# EasyEDA schematic examplePart-Name.json

## Sheets
1 Sheet_1: TITLE: Sheet_1; REV: 1.0; Date: 2020-12-12; Sheet: 1/1; Drawn By: HUANsic; Company: Your Company
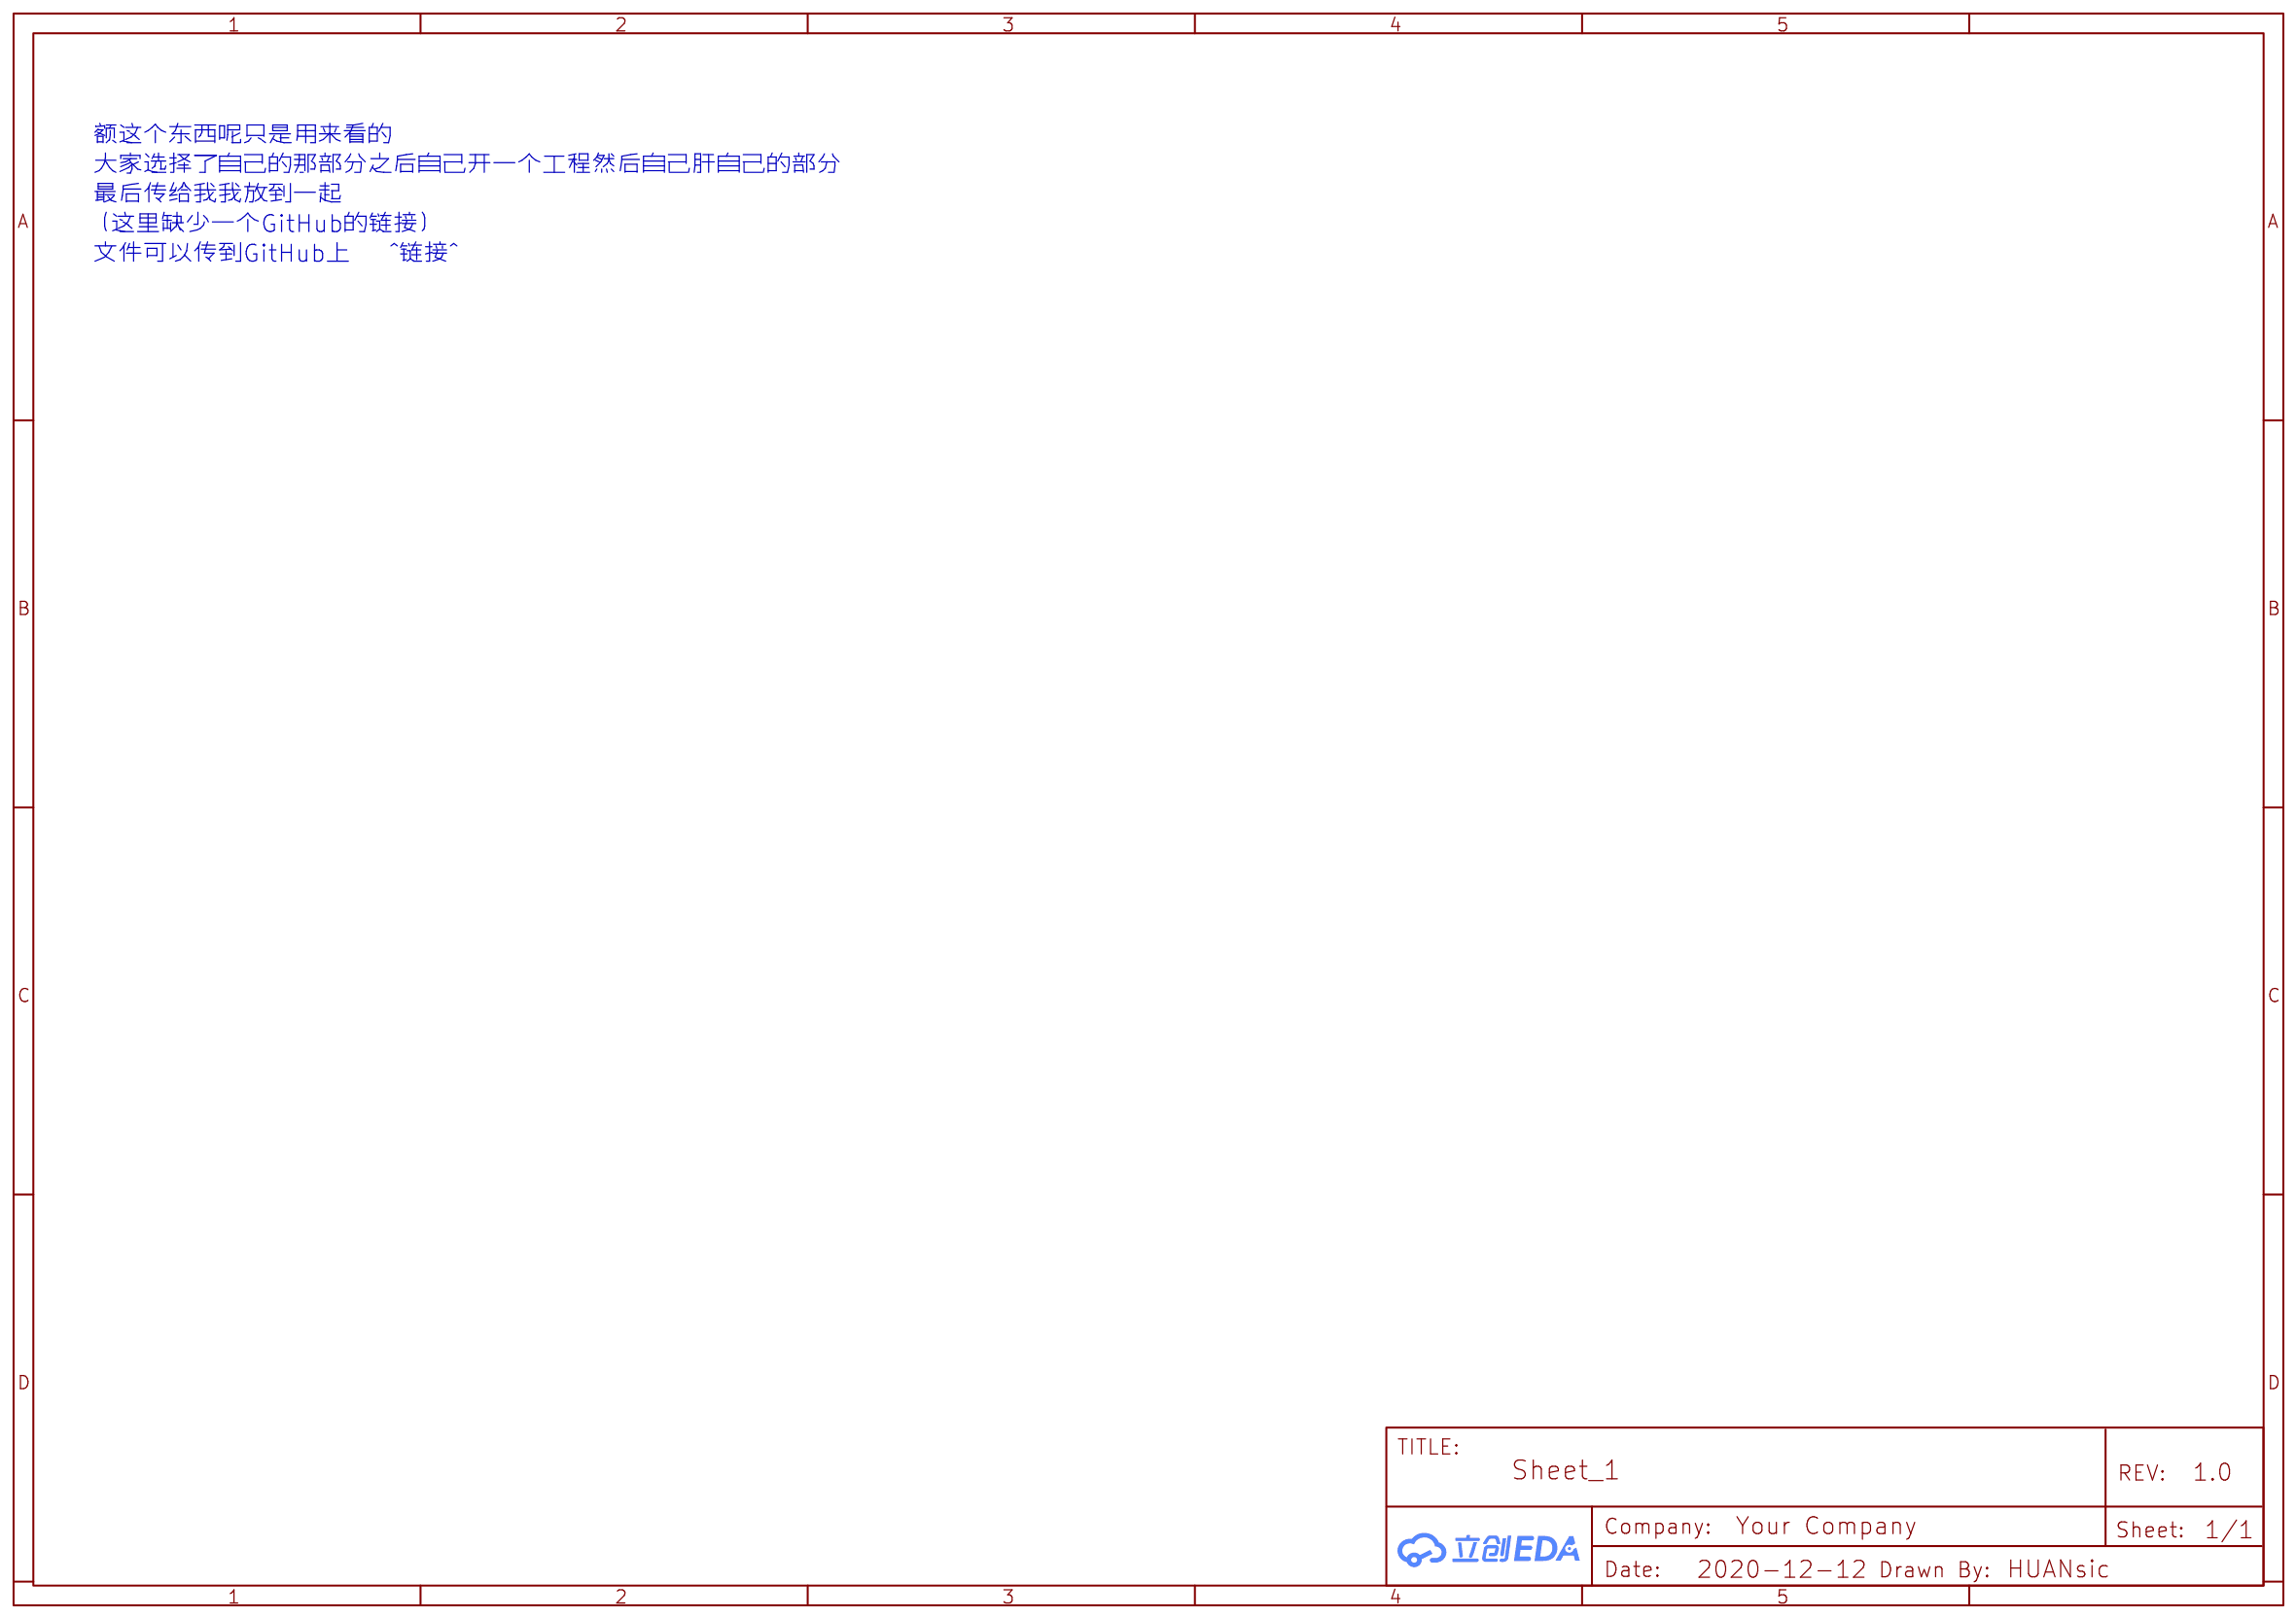
[diagram p0: Sheet_1]
2 RegFile: TITLE: Sheet_2
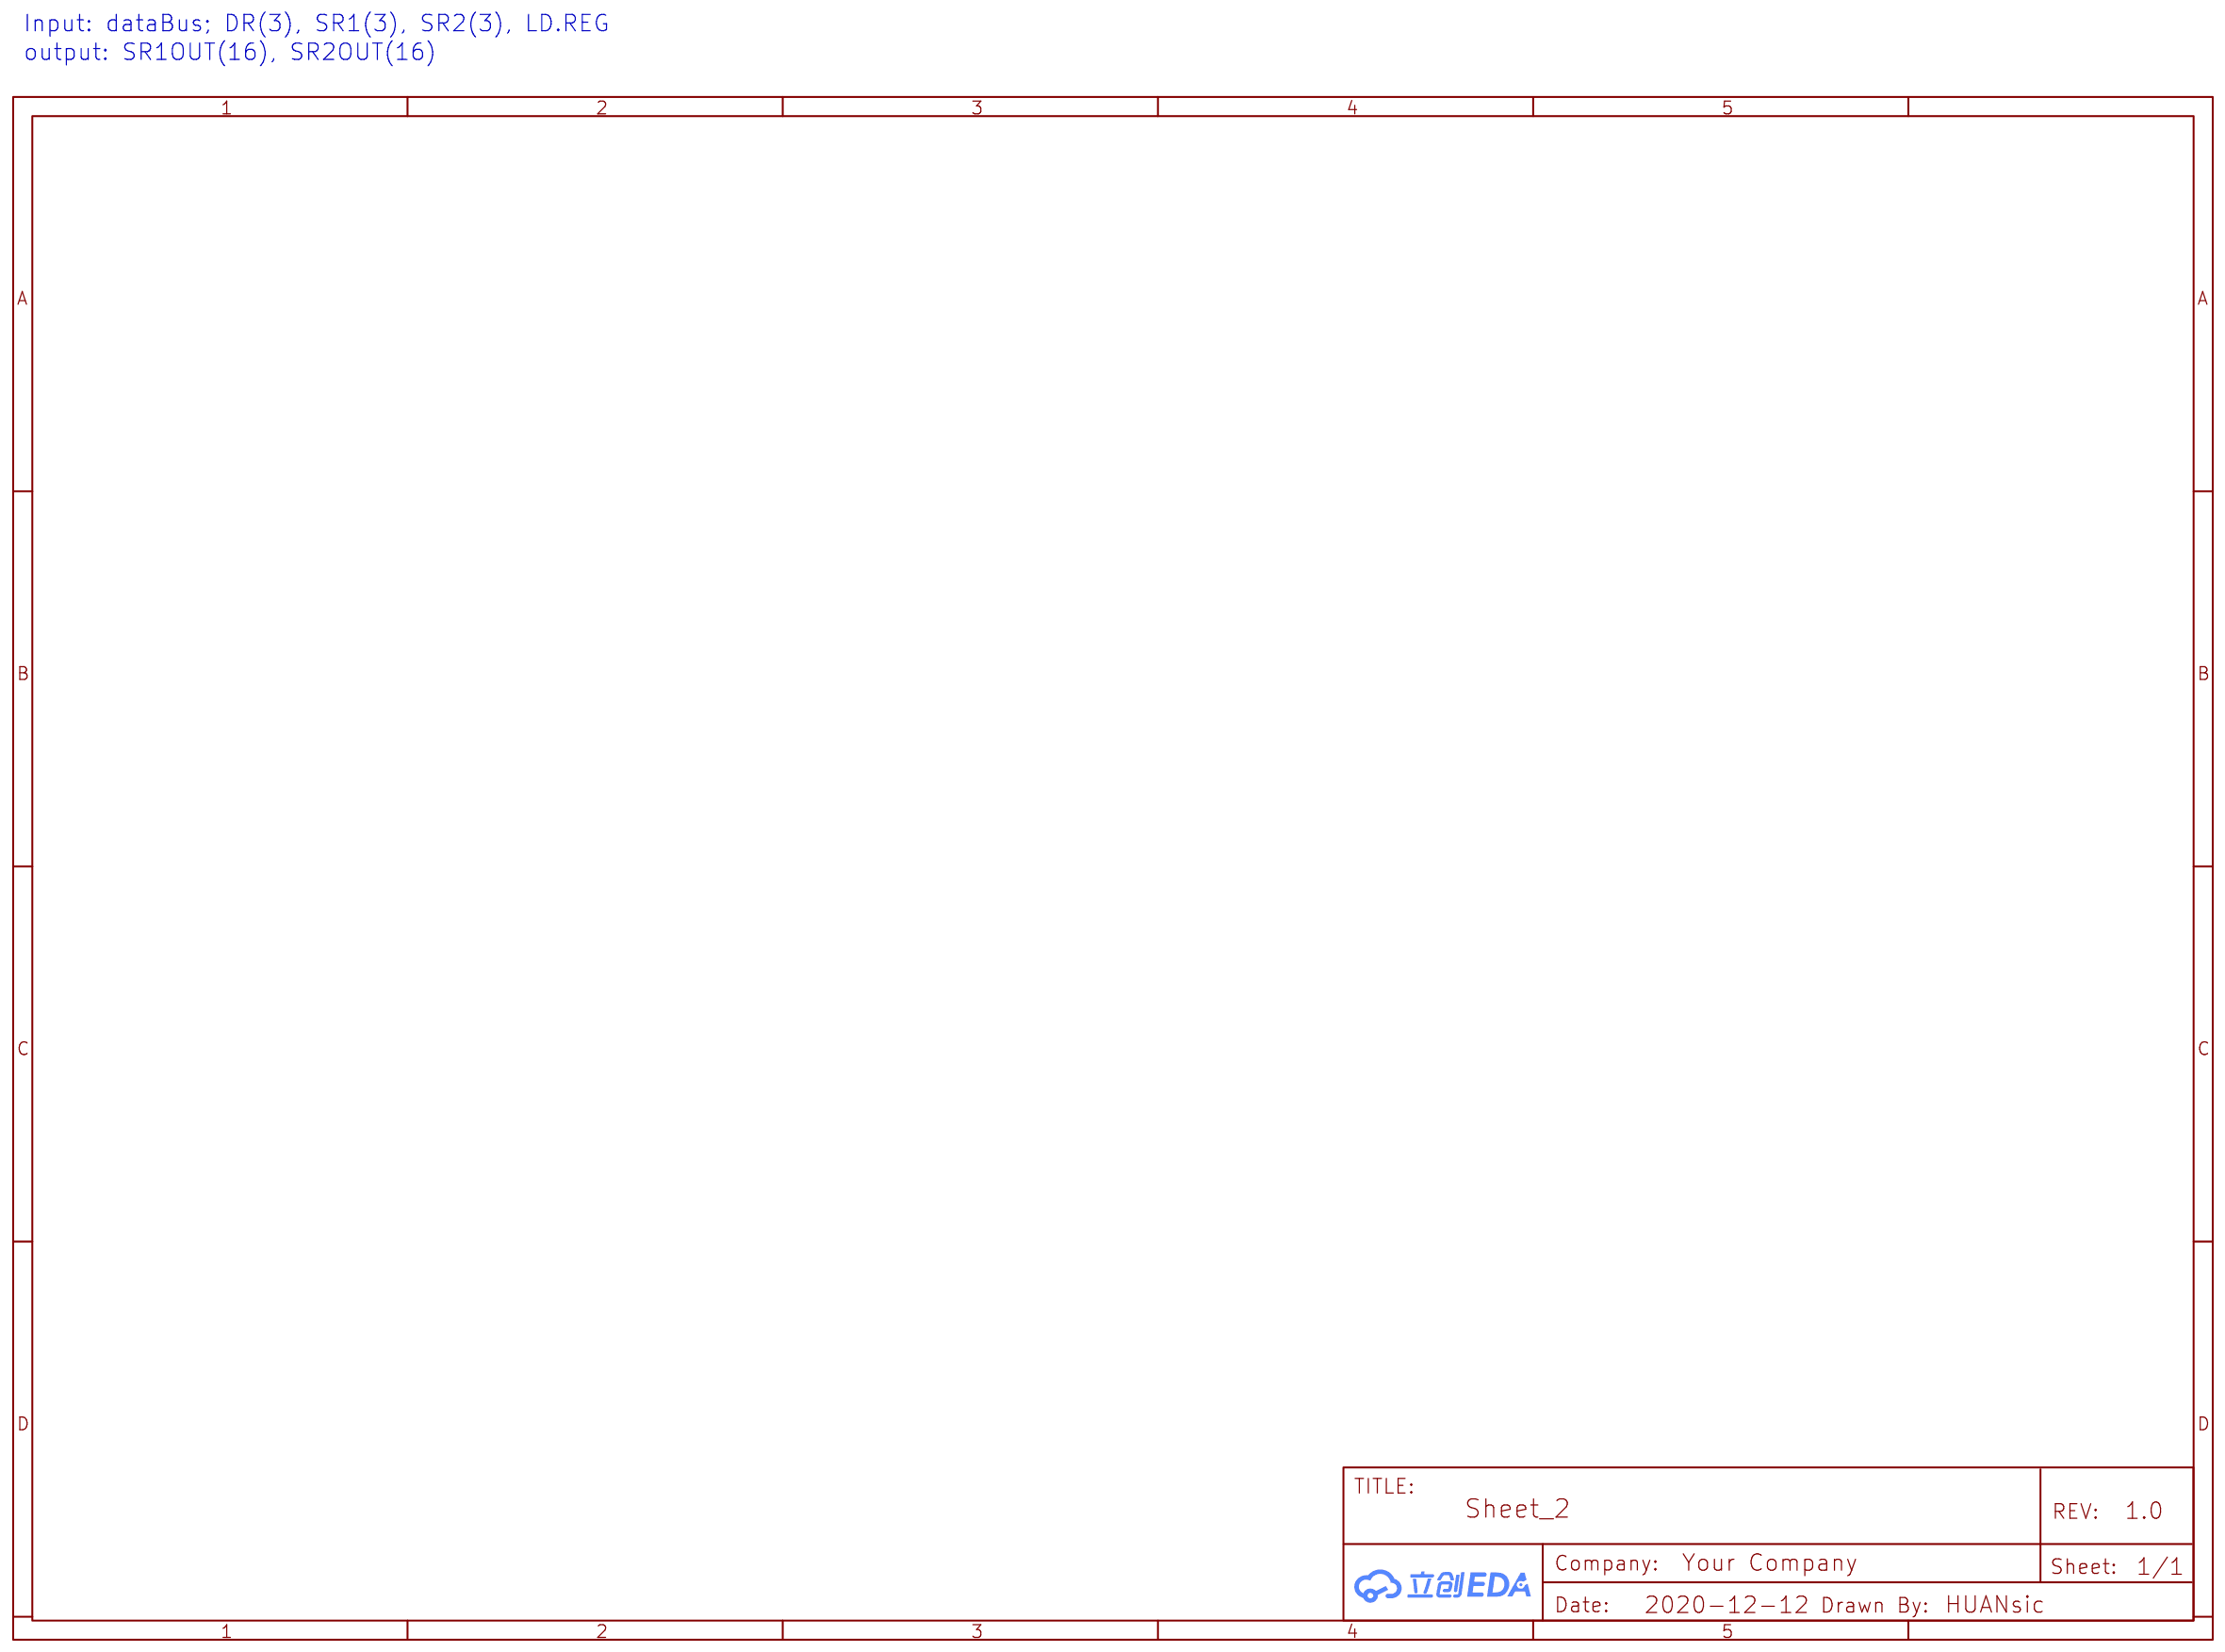
[diagram p1: RegFile]
3 PC_: TITLE: Sheet_2
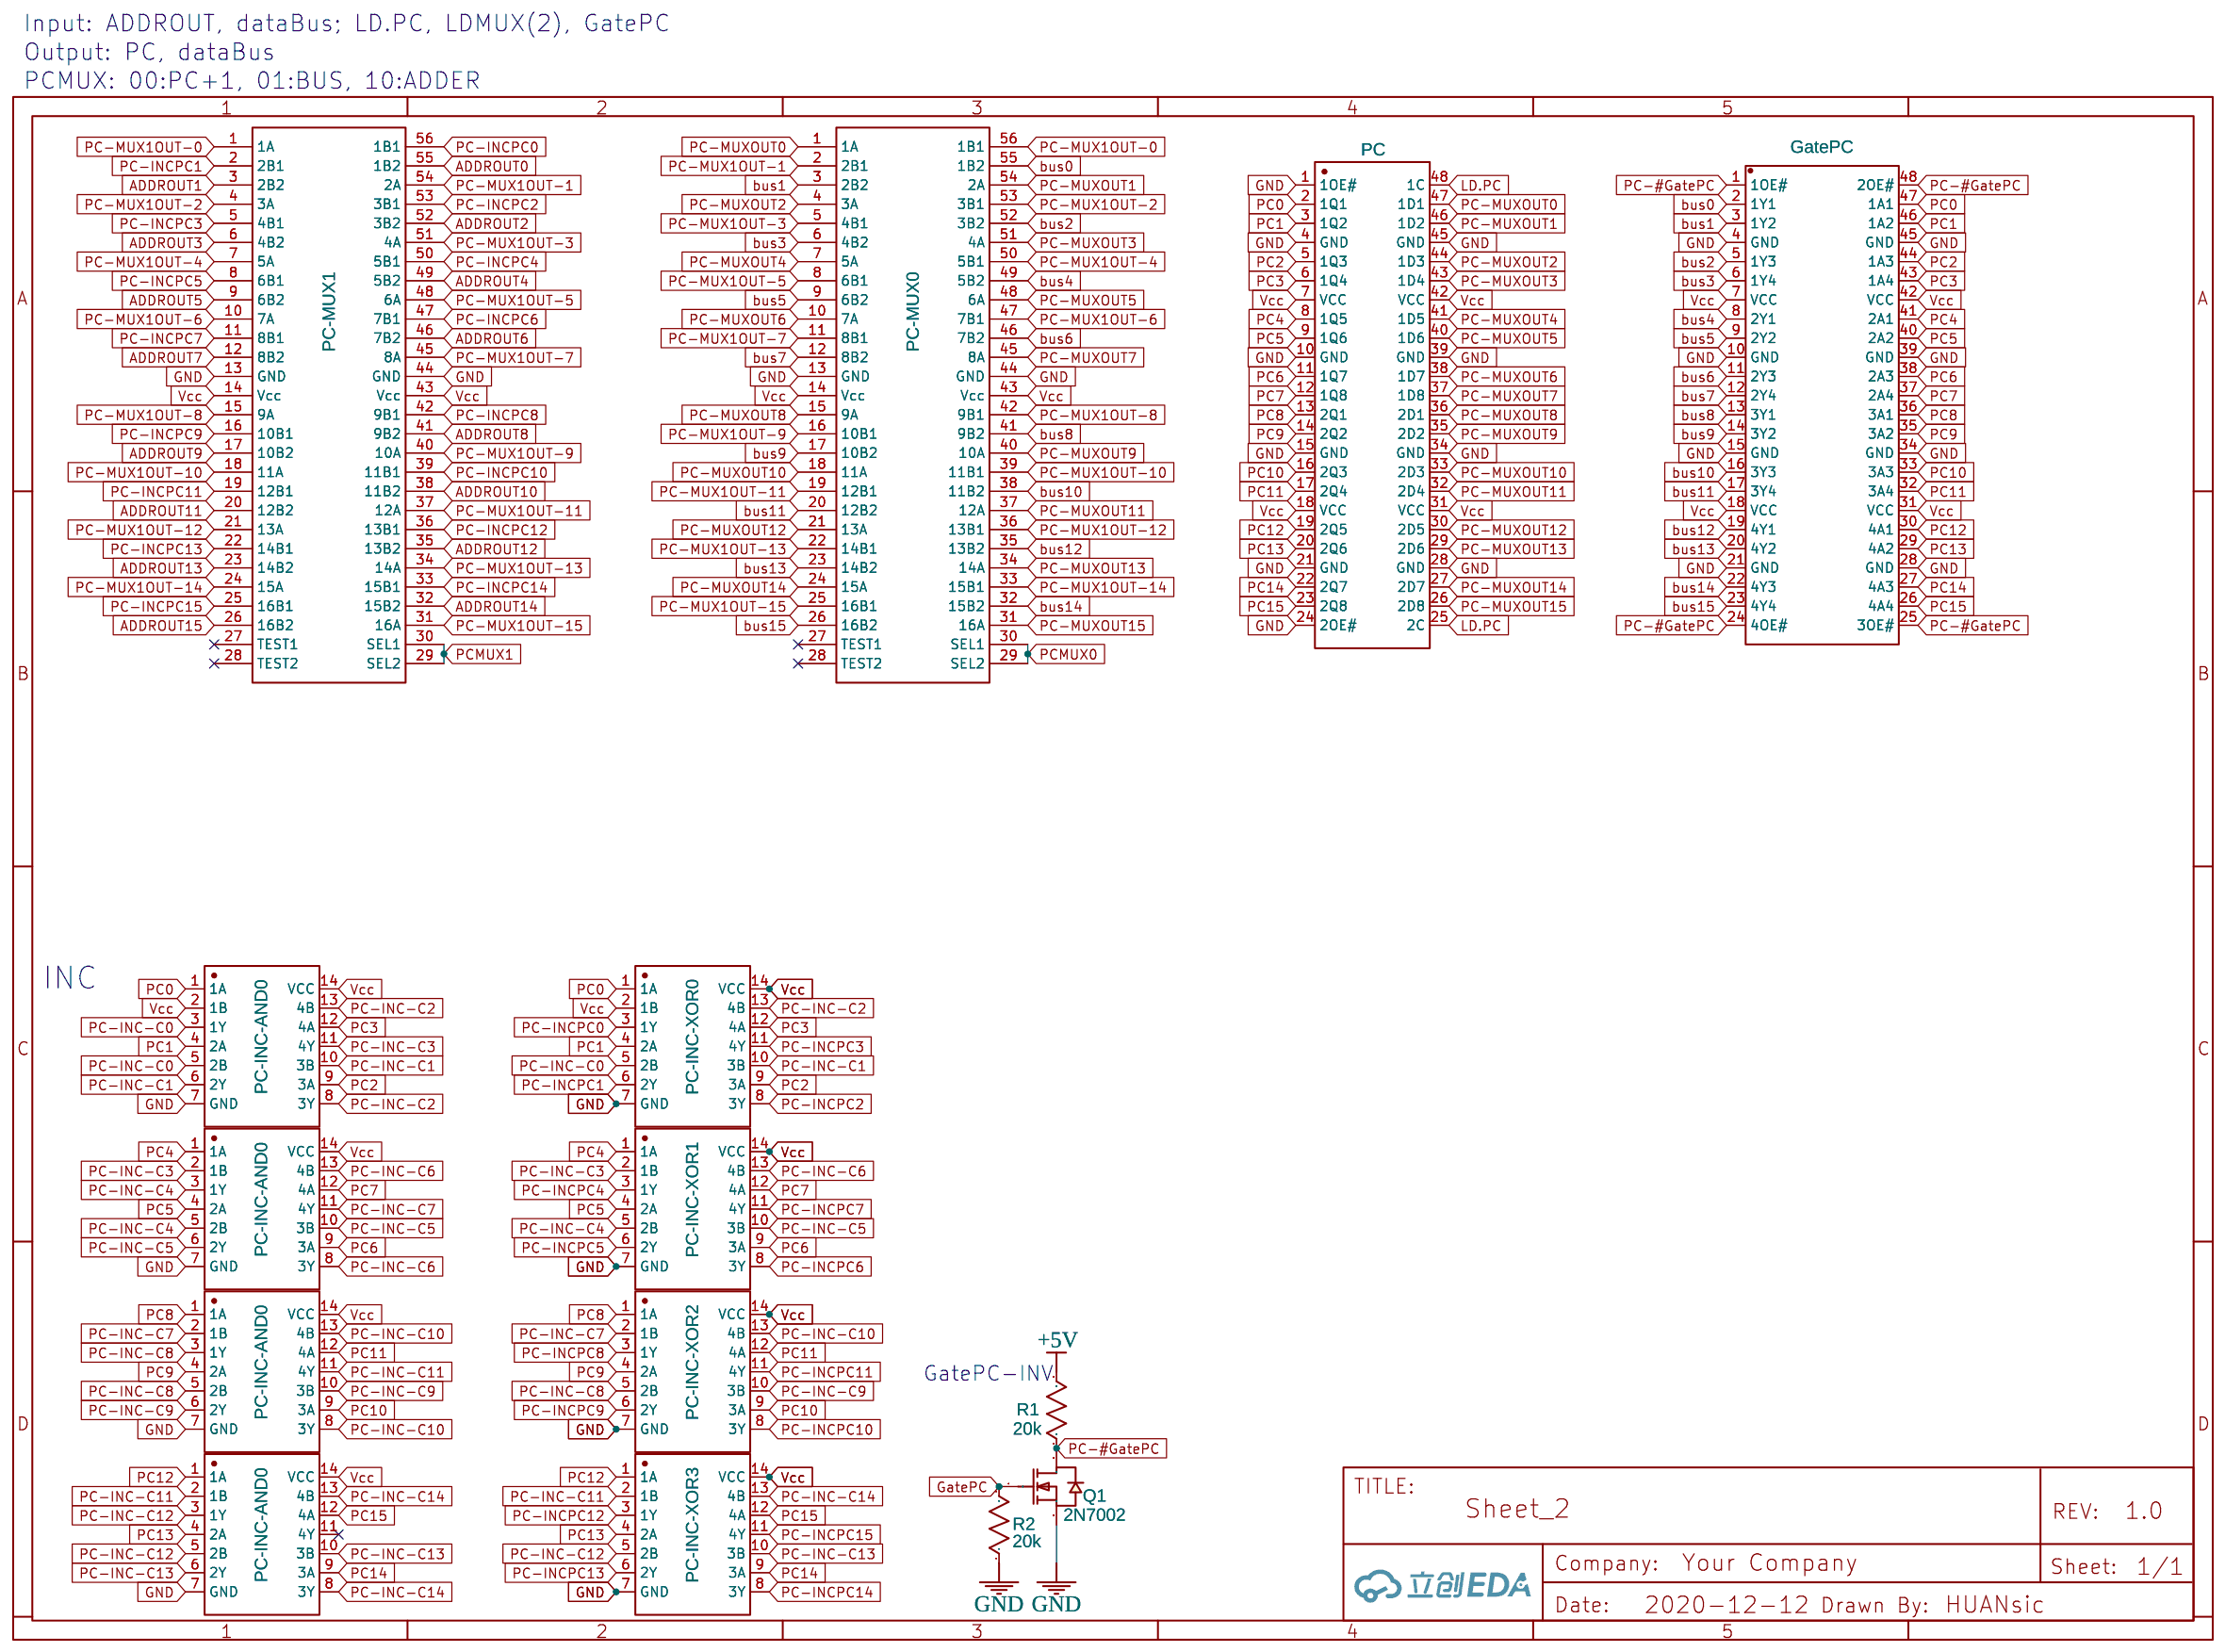
[diagram p2: PC_]
4 CONTROL: TITLE: Sheet_2
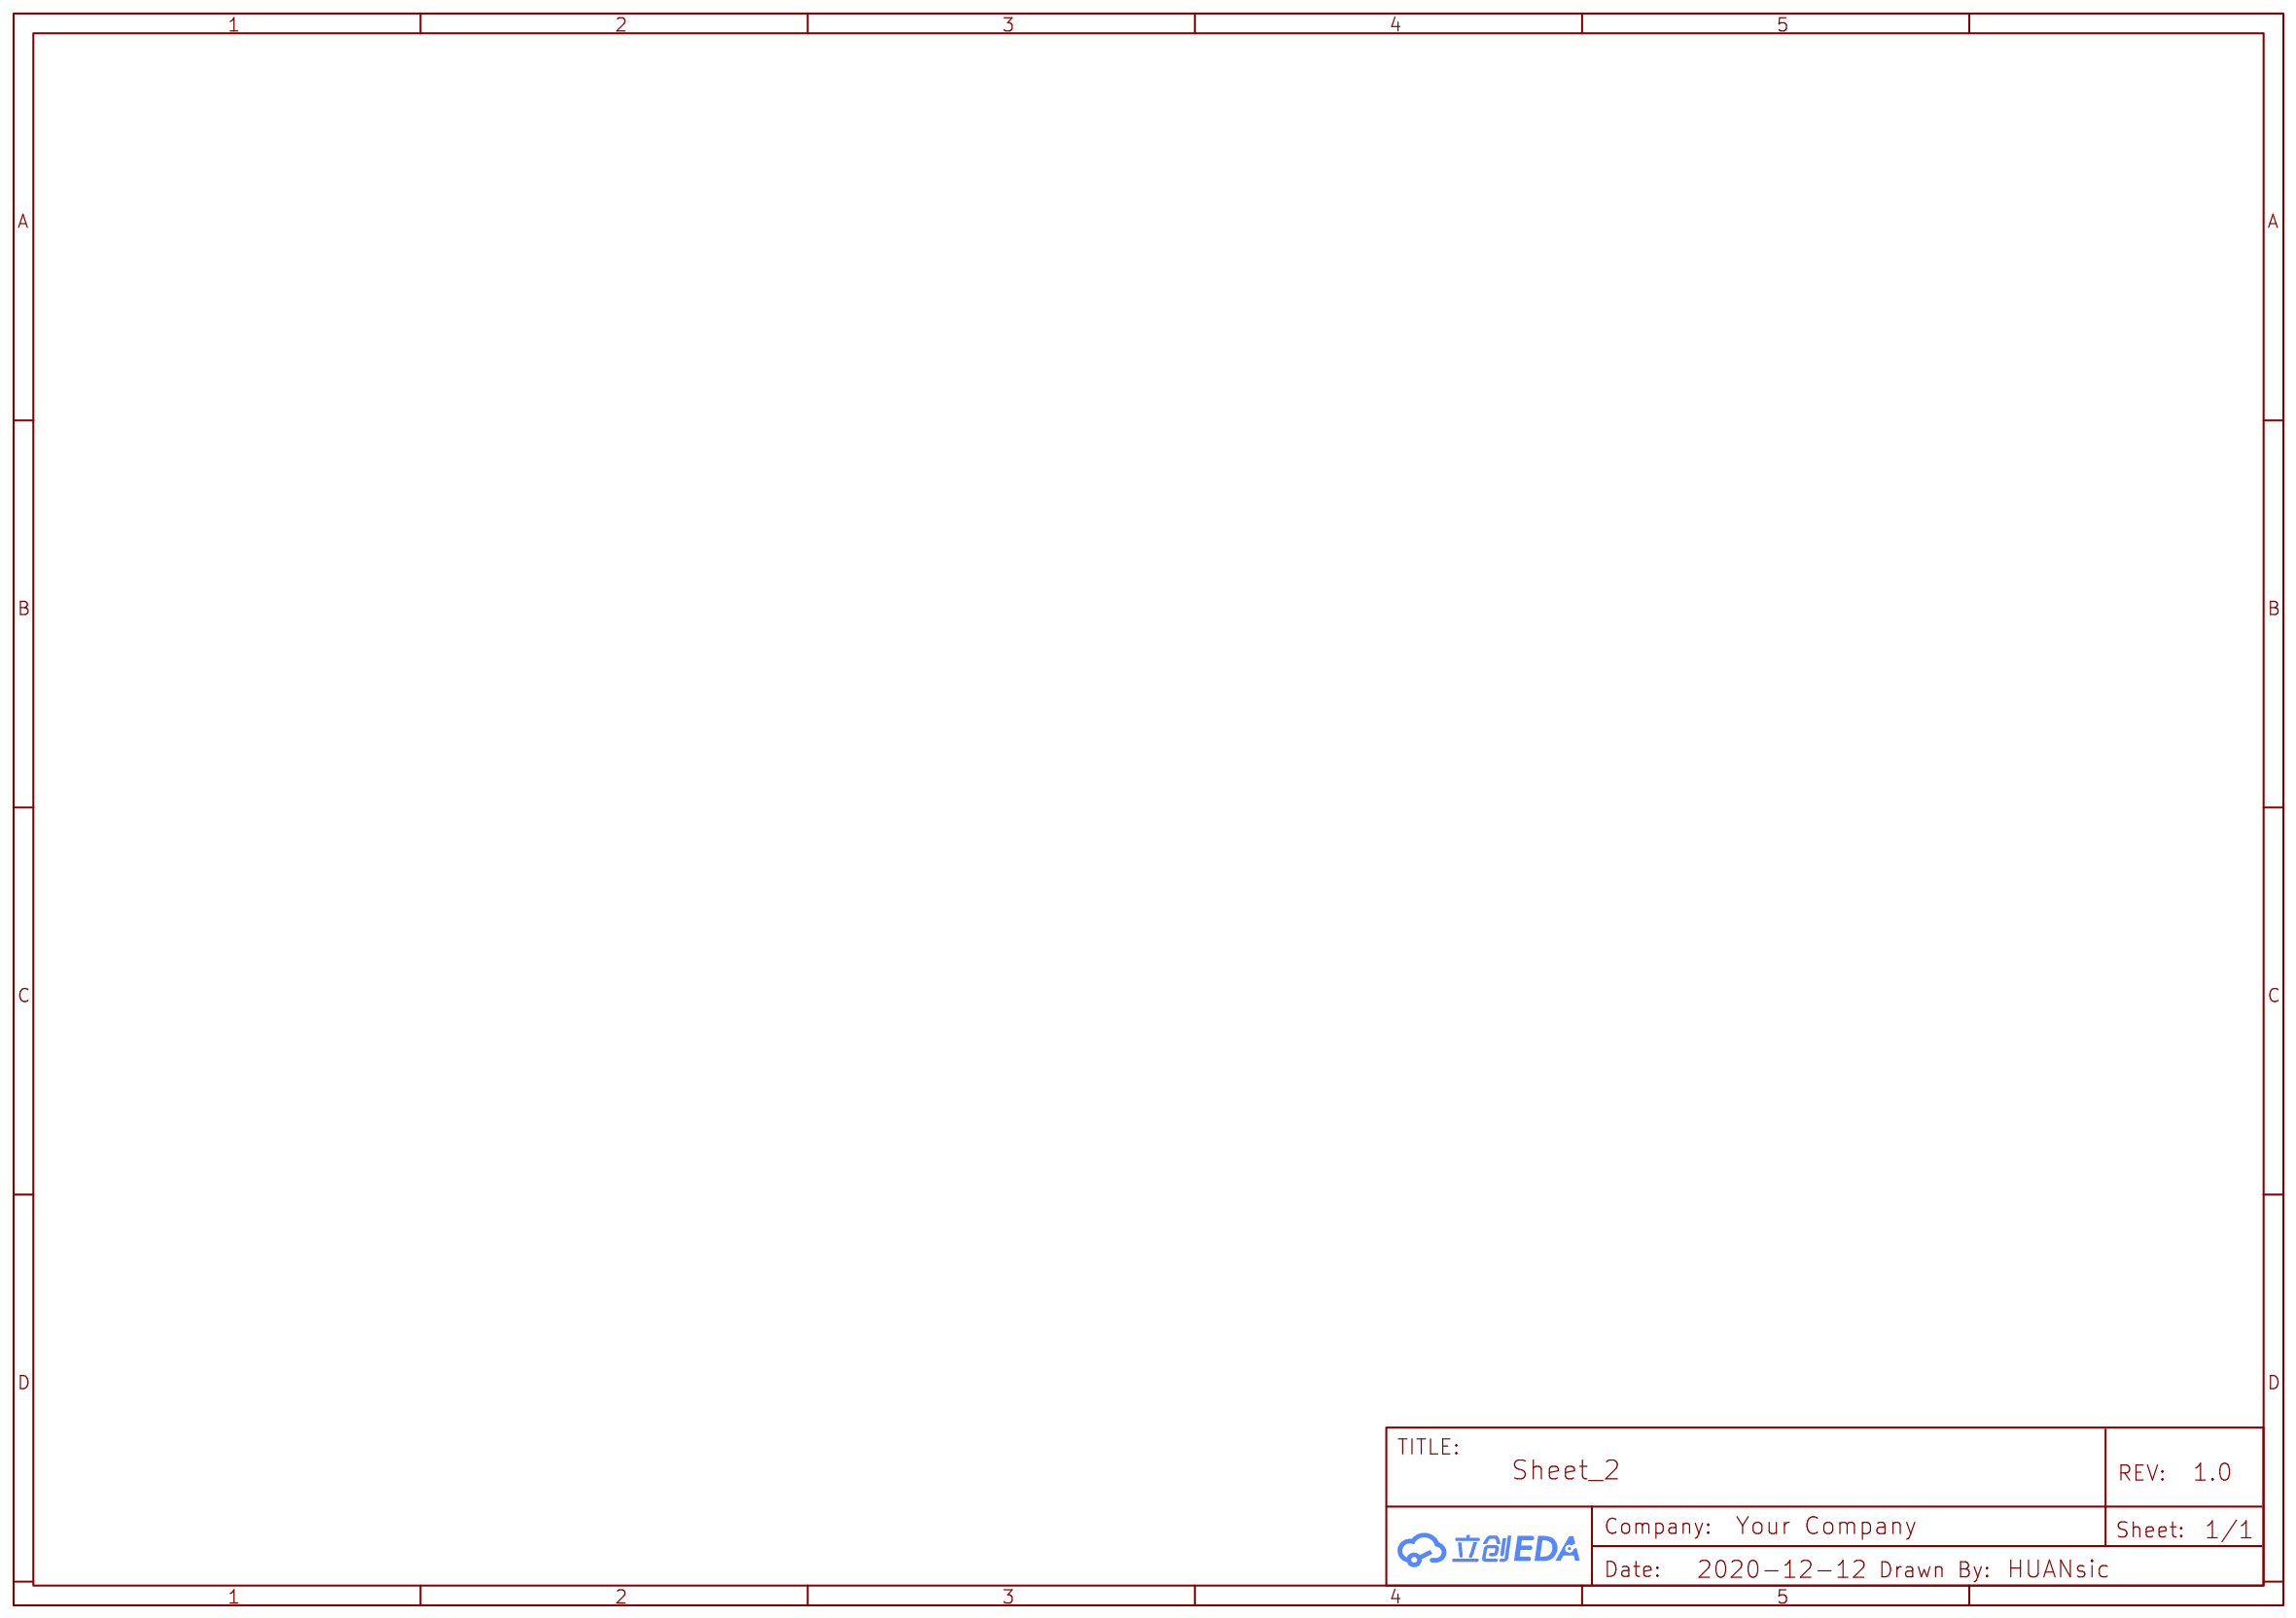
[diagram p3: CONTROL]
5 MARMUX: TITLE: Sheet_2
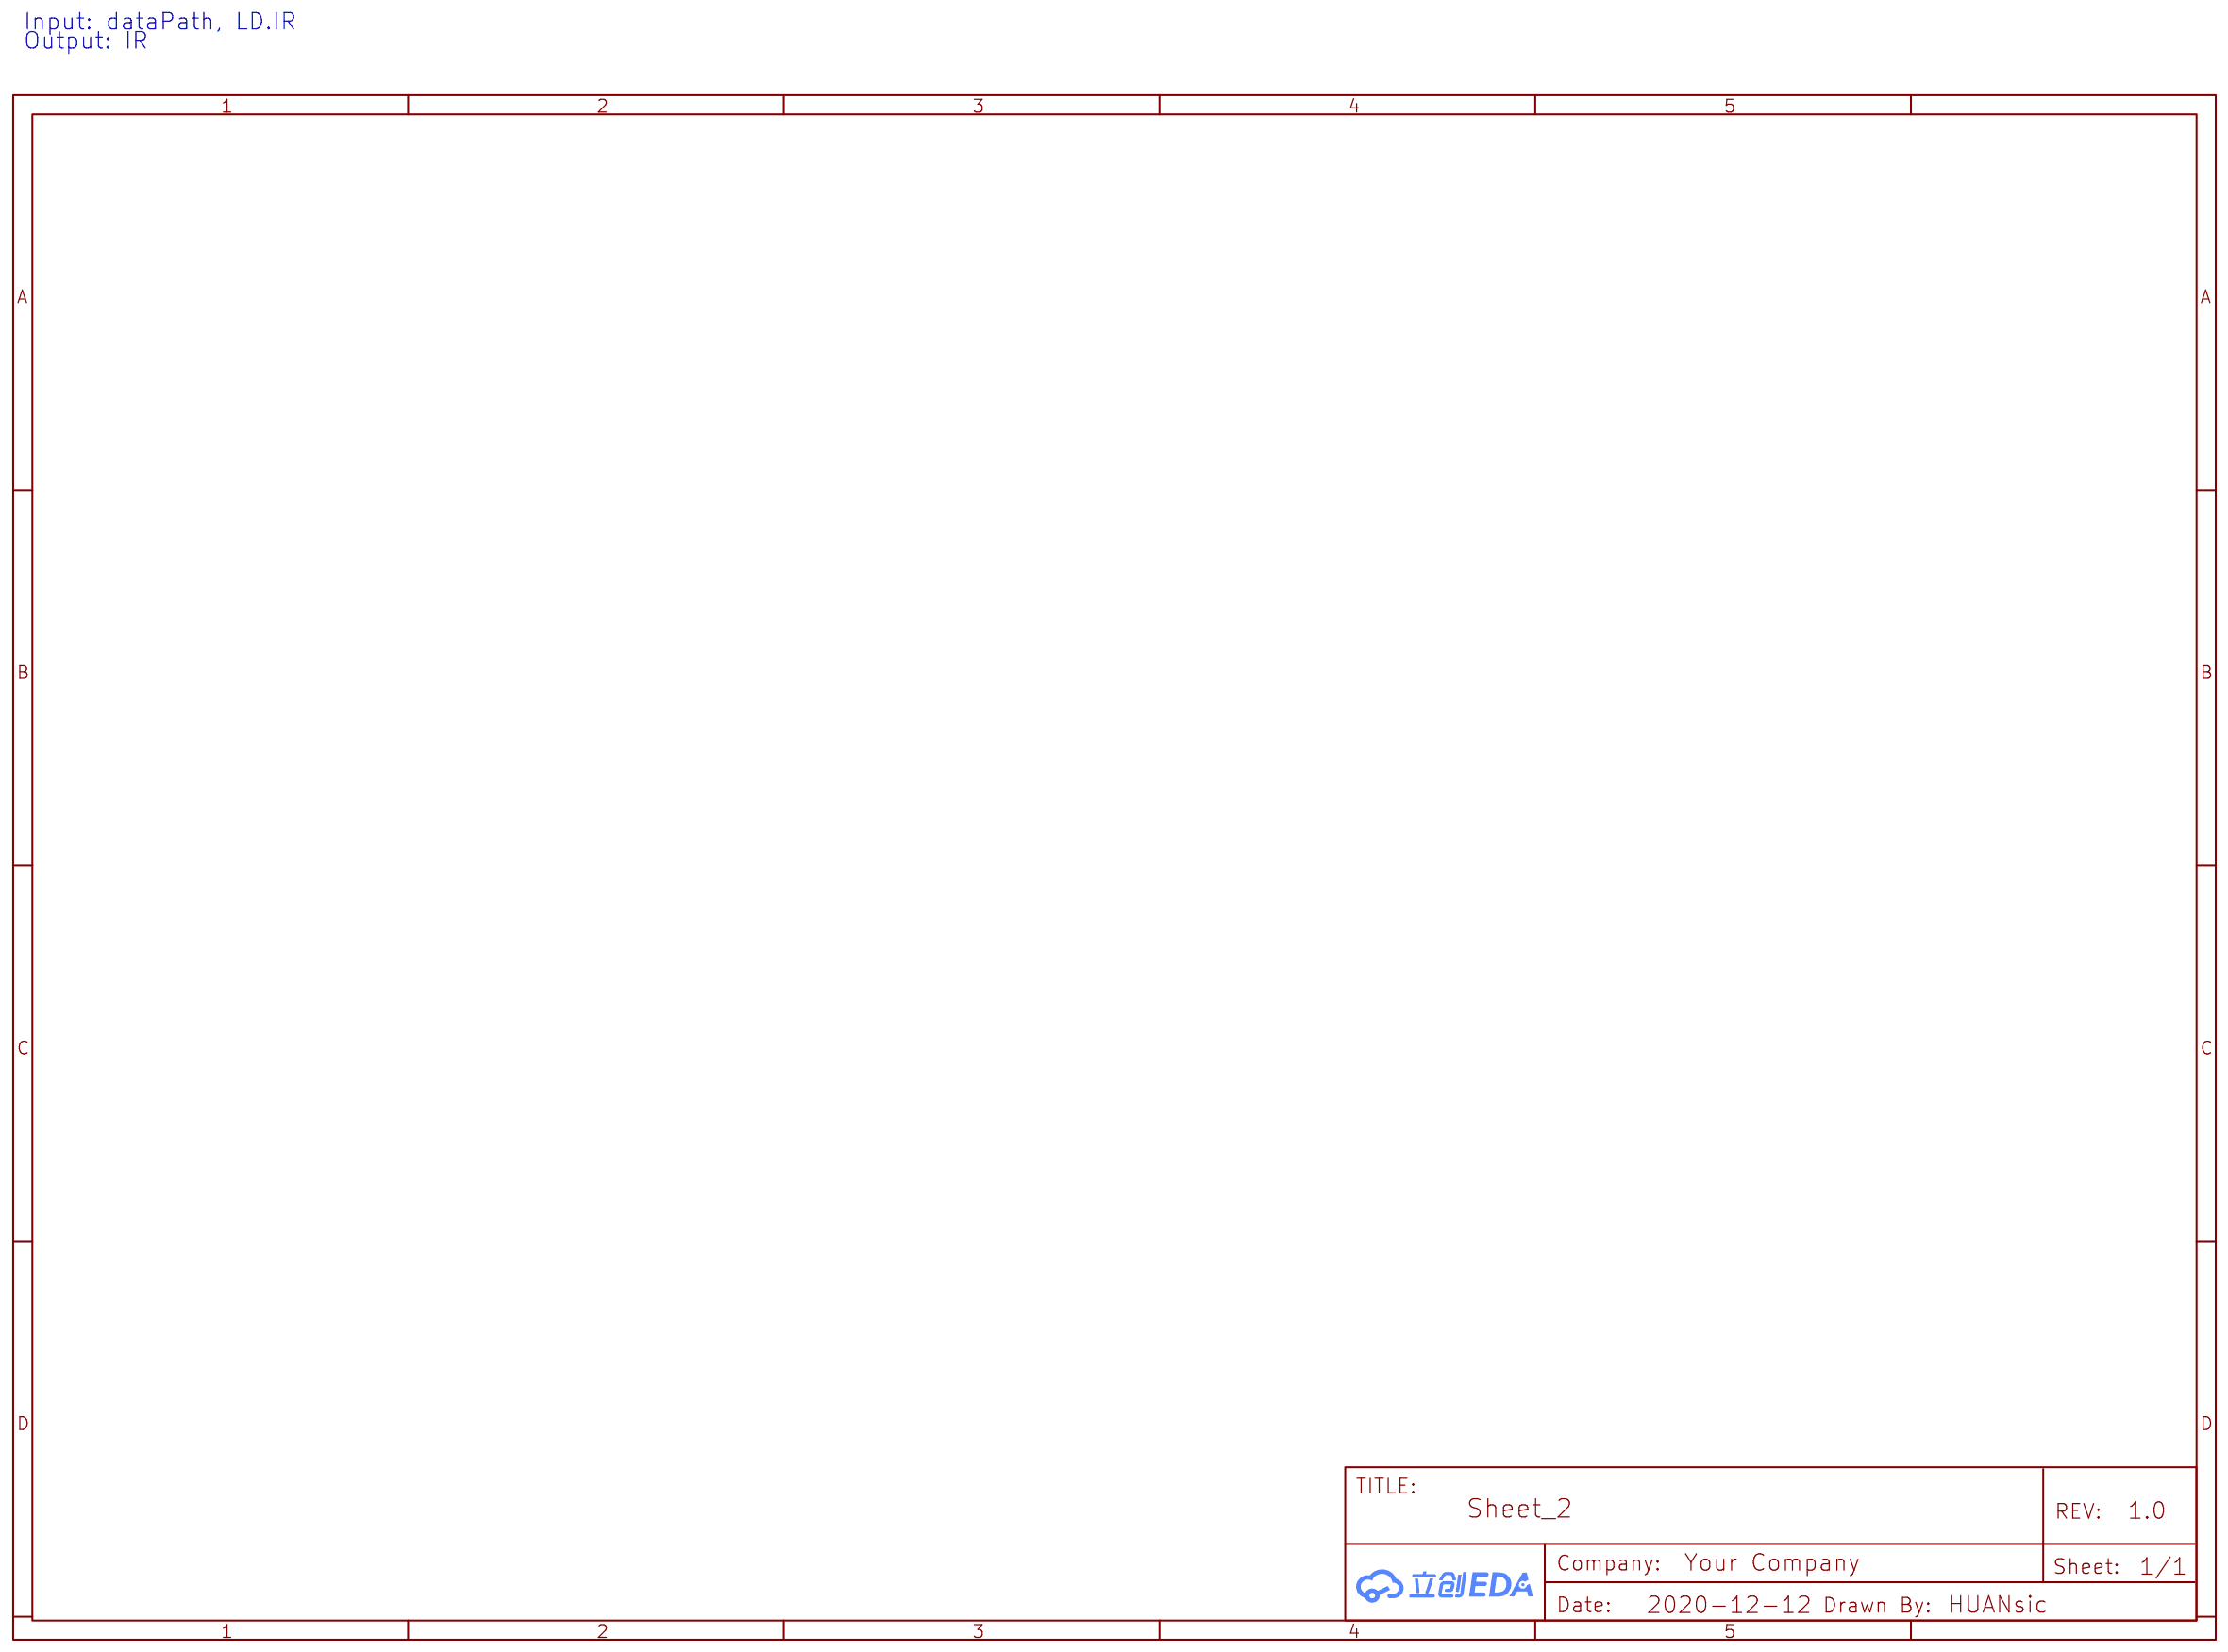
[diagram p4: MARMUX]
6 IR: TITLE: Sheet_2
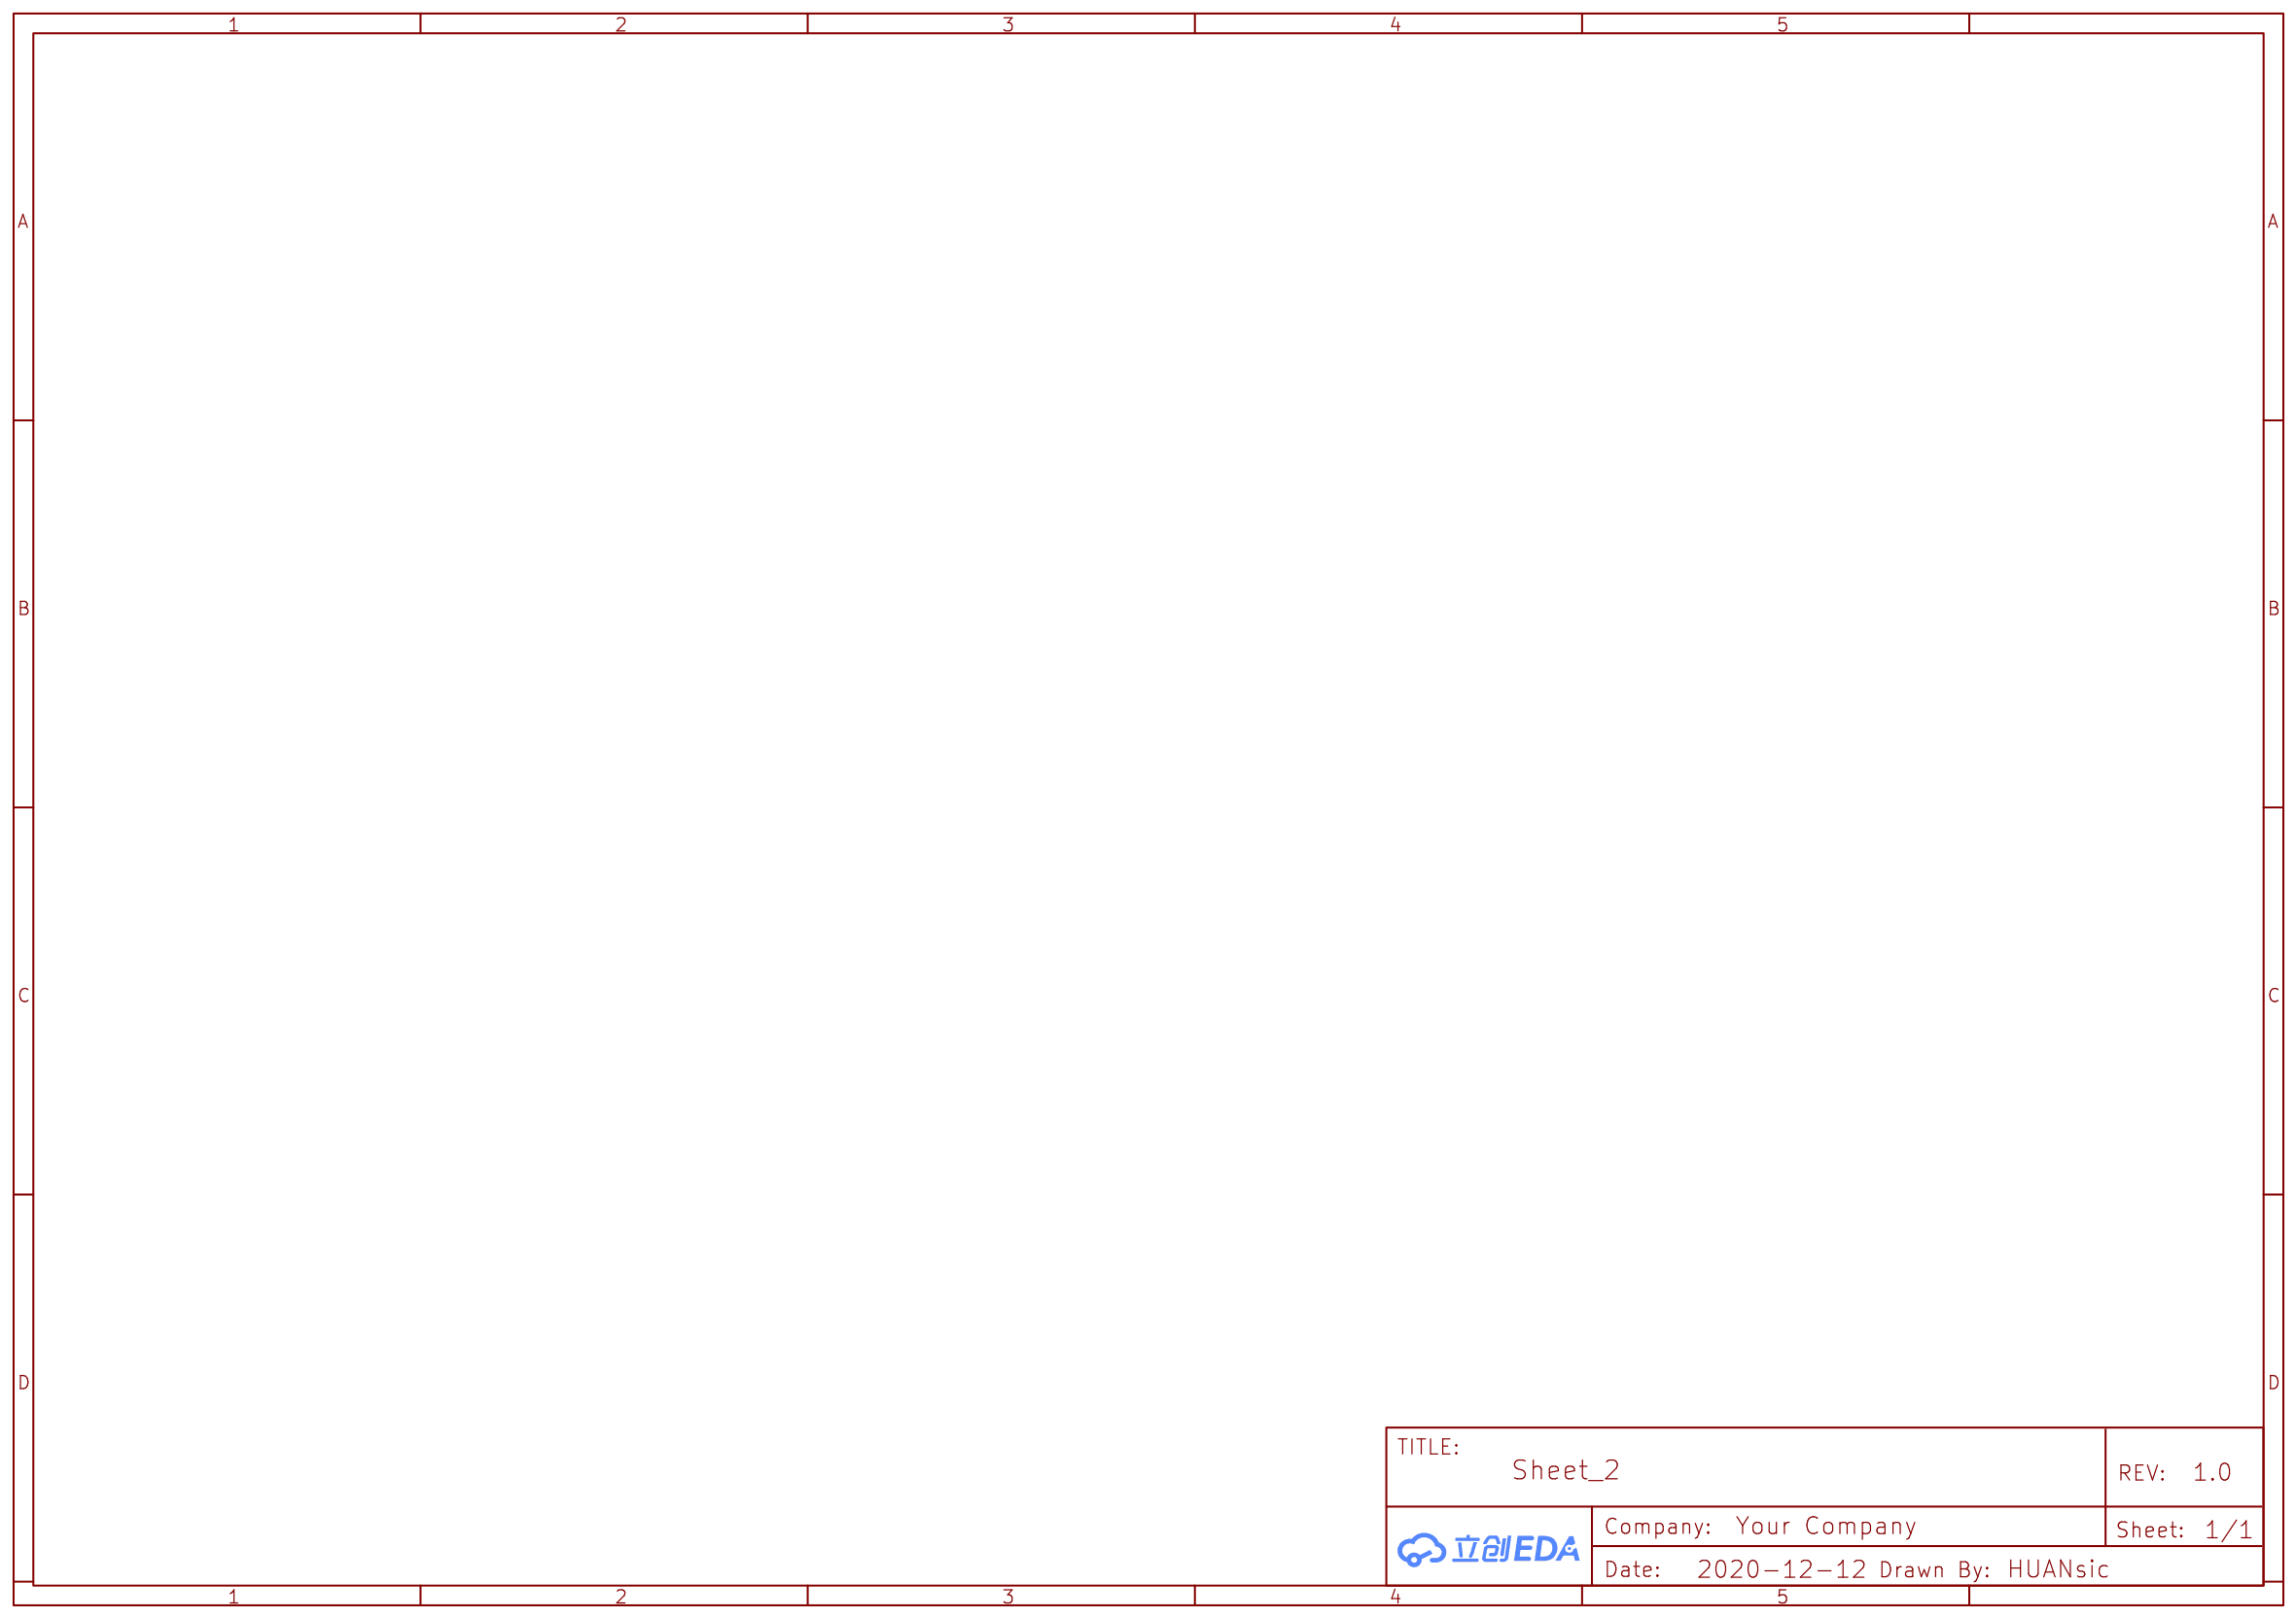
[diagram p5: IR]
7 NZPLOGIC: TITLE: Sheet_2
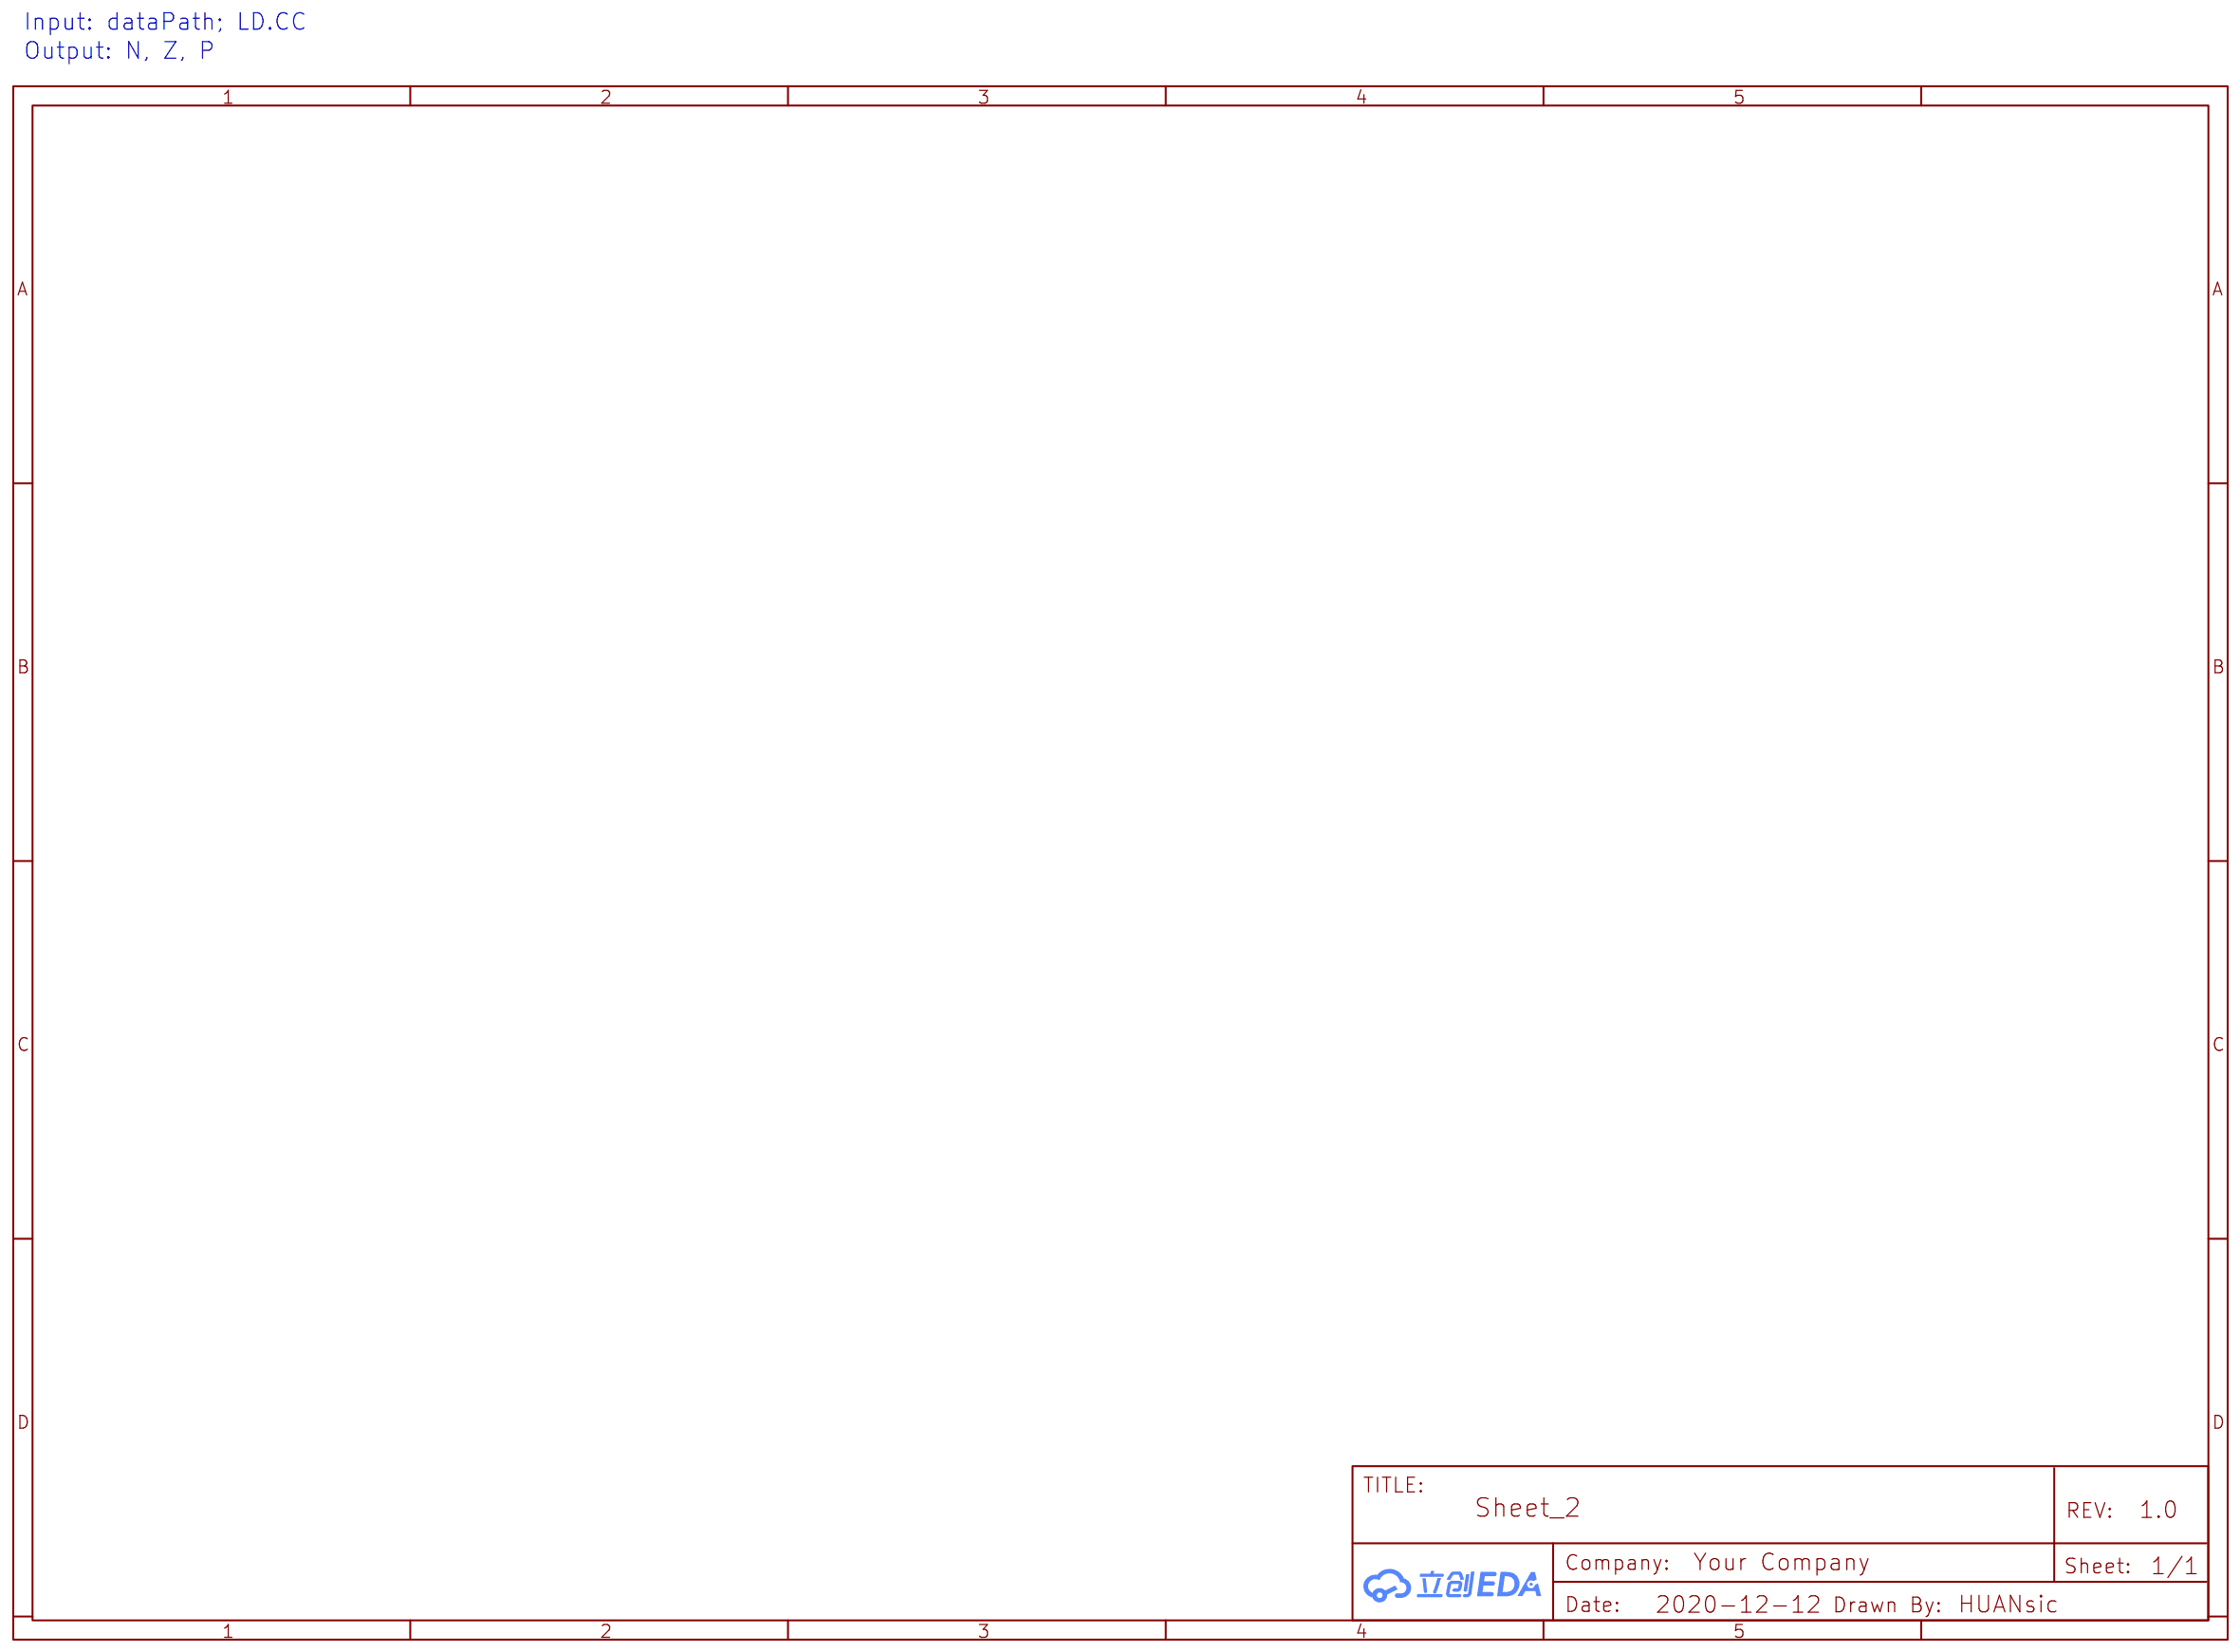
[diagram p6: NZPLOGIC]
8 ADDR1: TITLE: Sheet_2
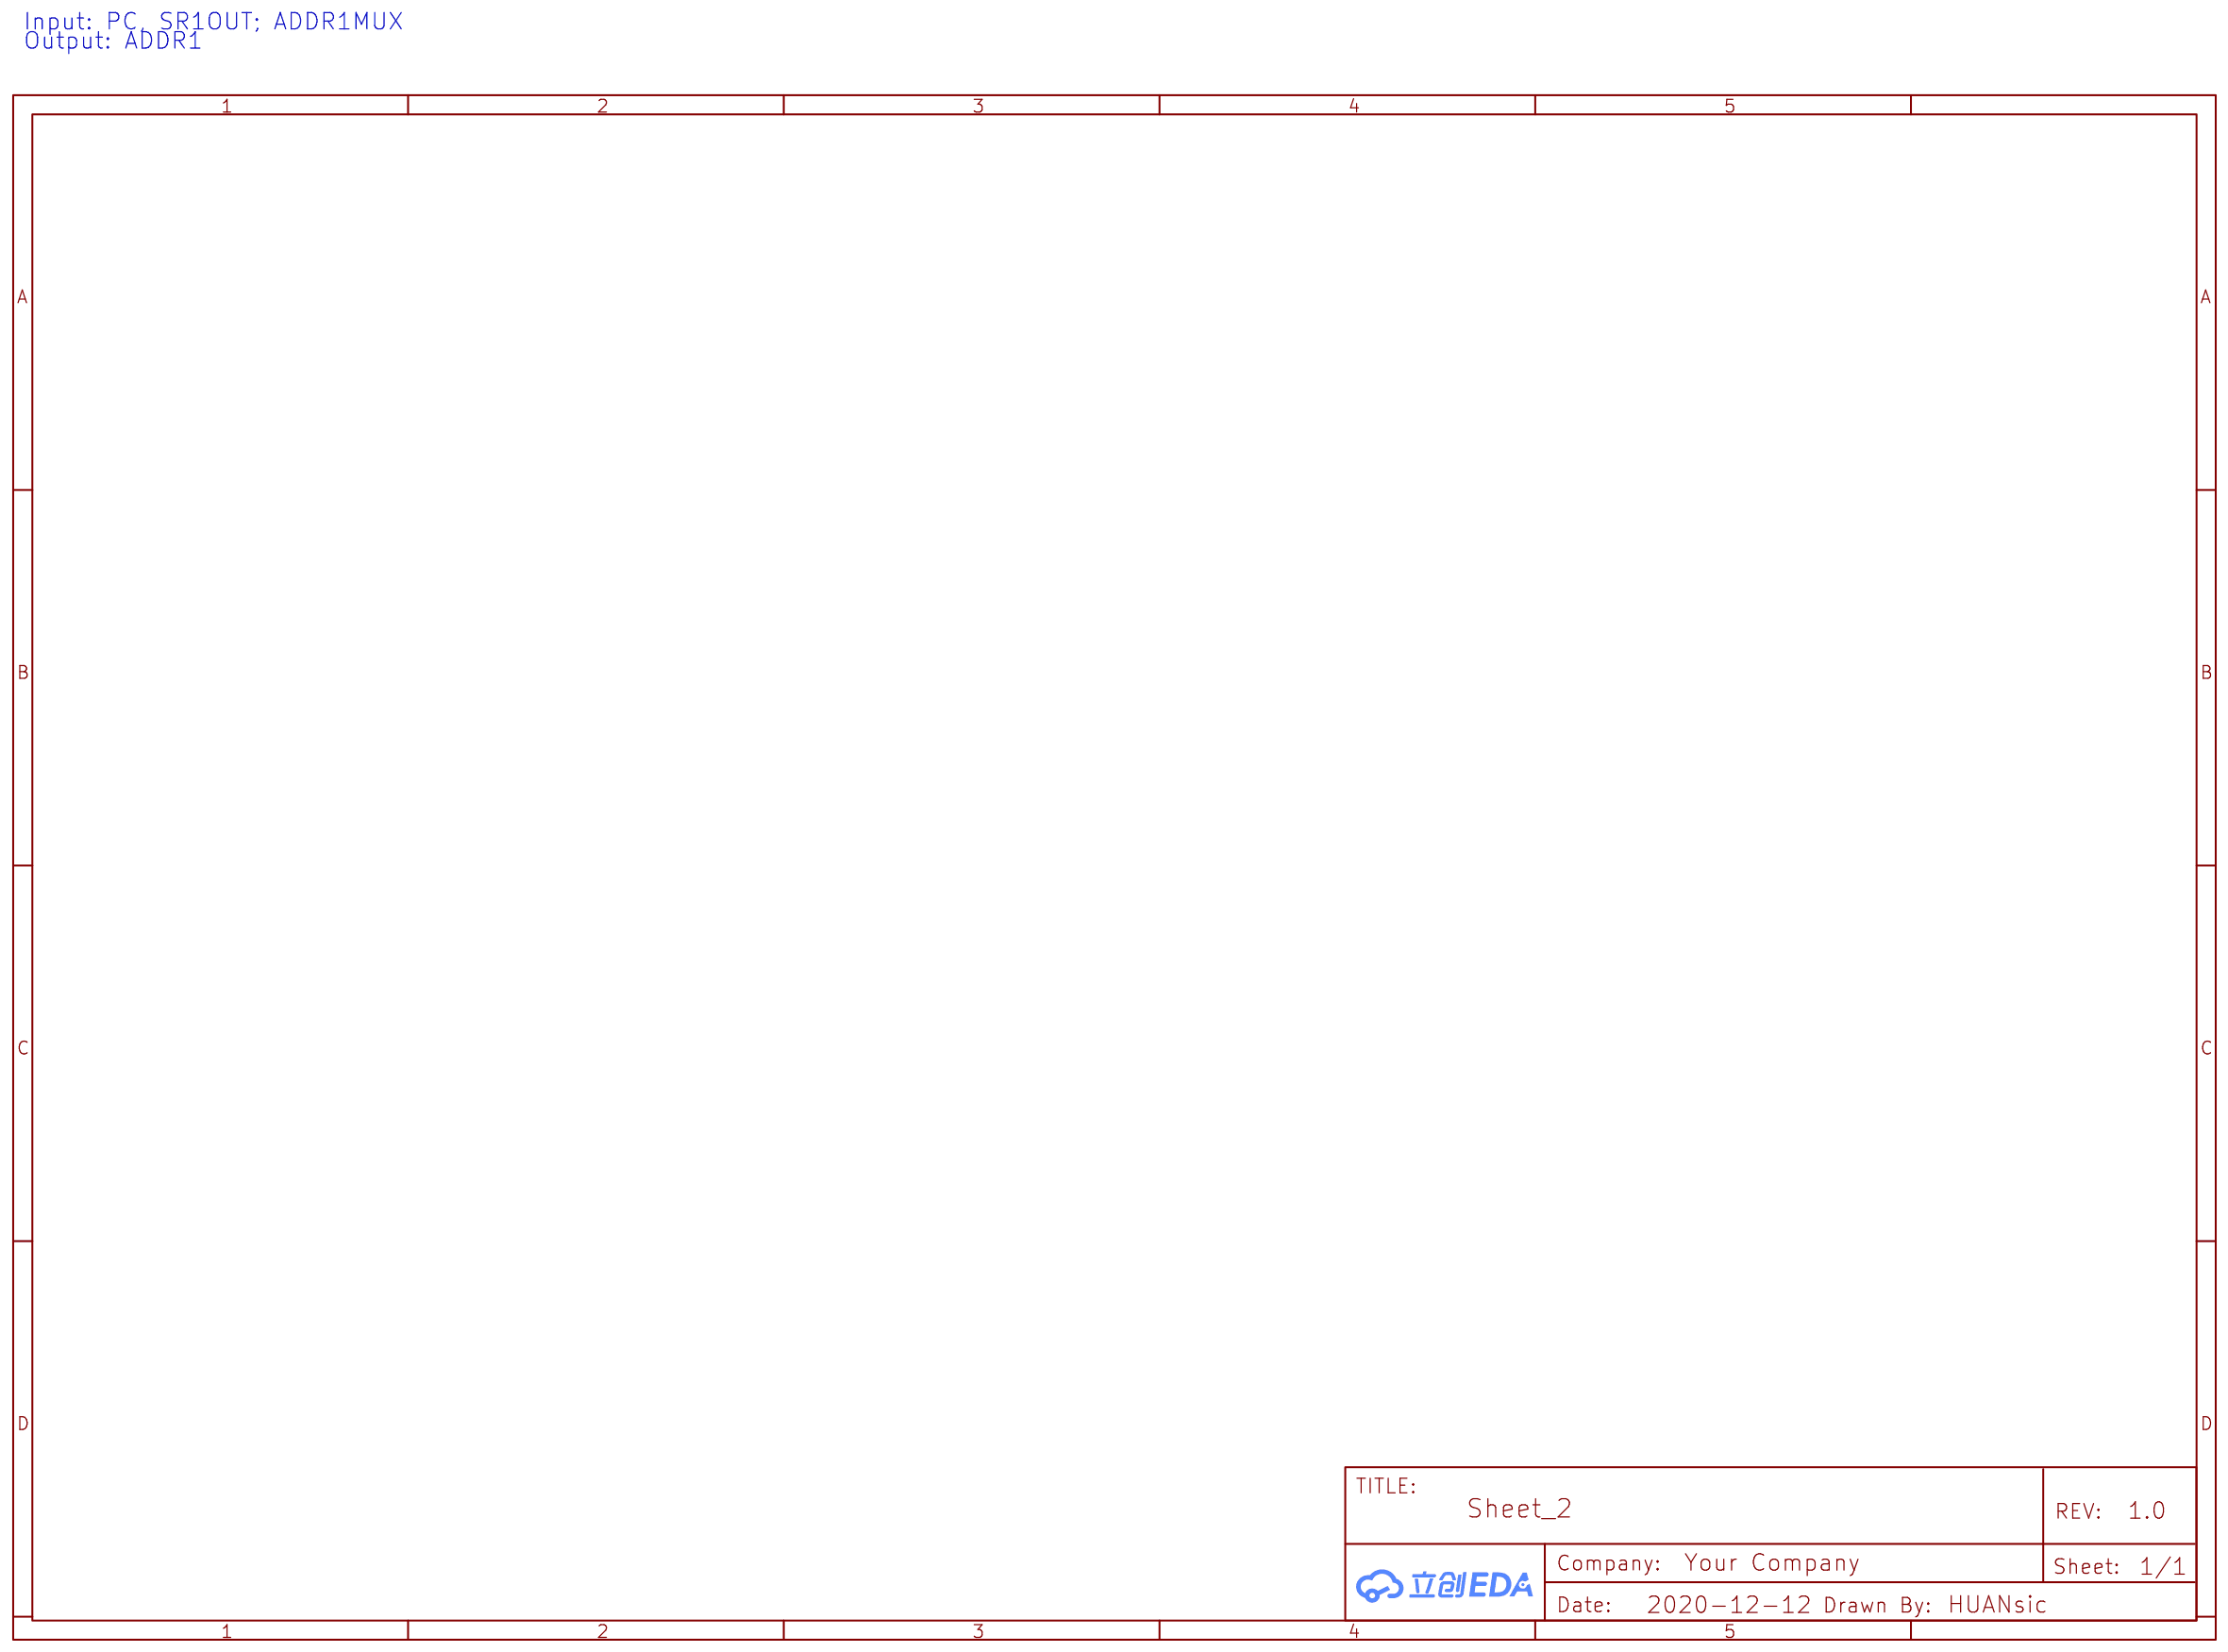
[diagram p7: ADDR1]
9 ADDR2: TITLE: Sheet_2
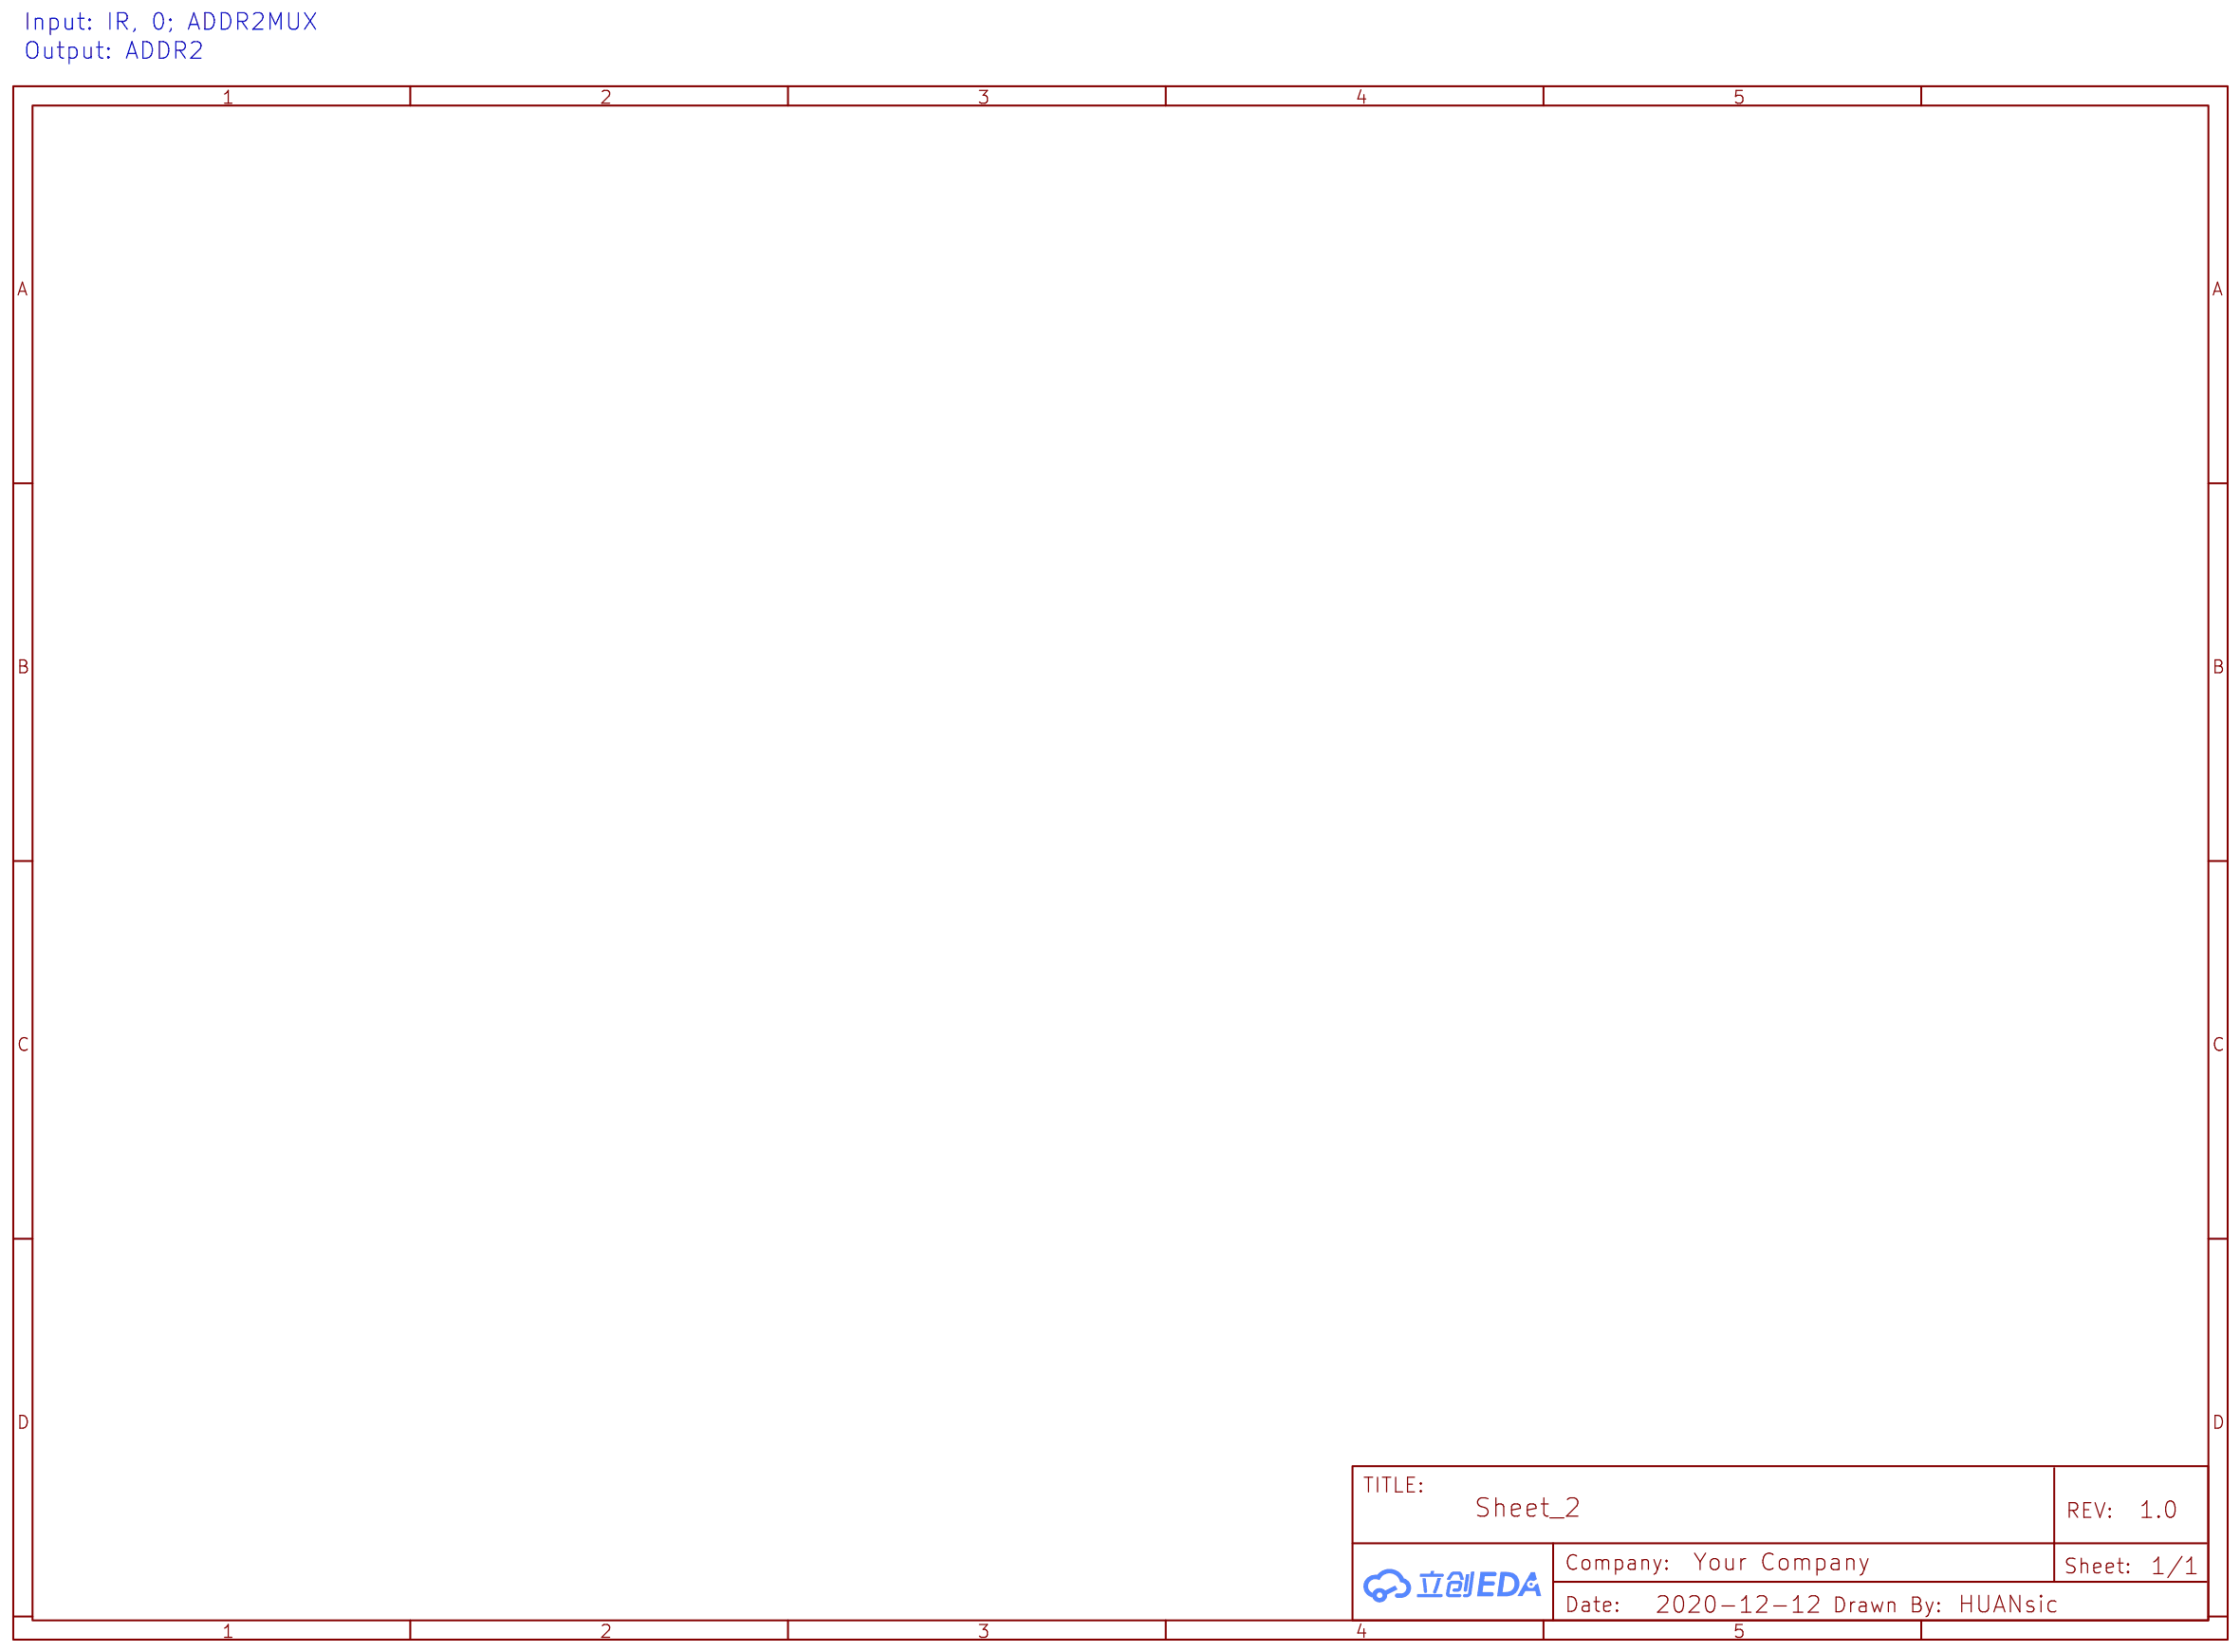
[diagram p8: ADDR2]
10 ALU_: TITLE: Sheet_2
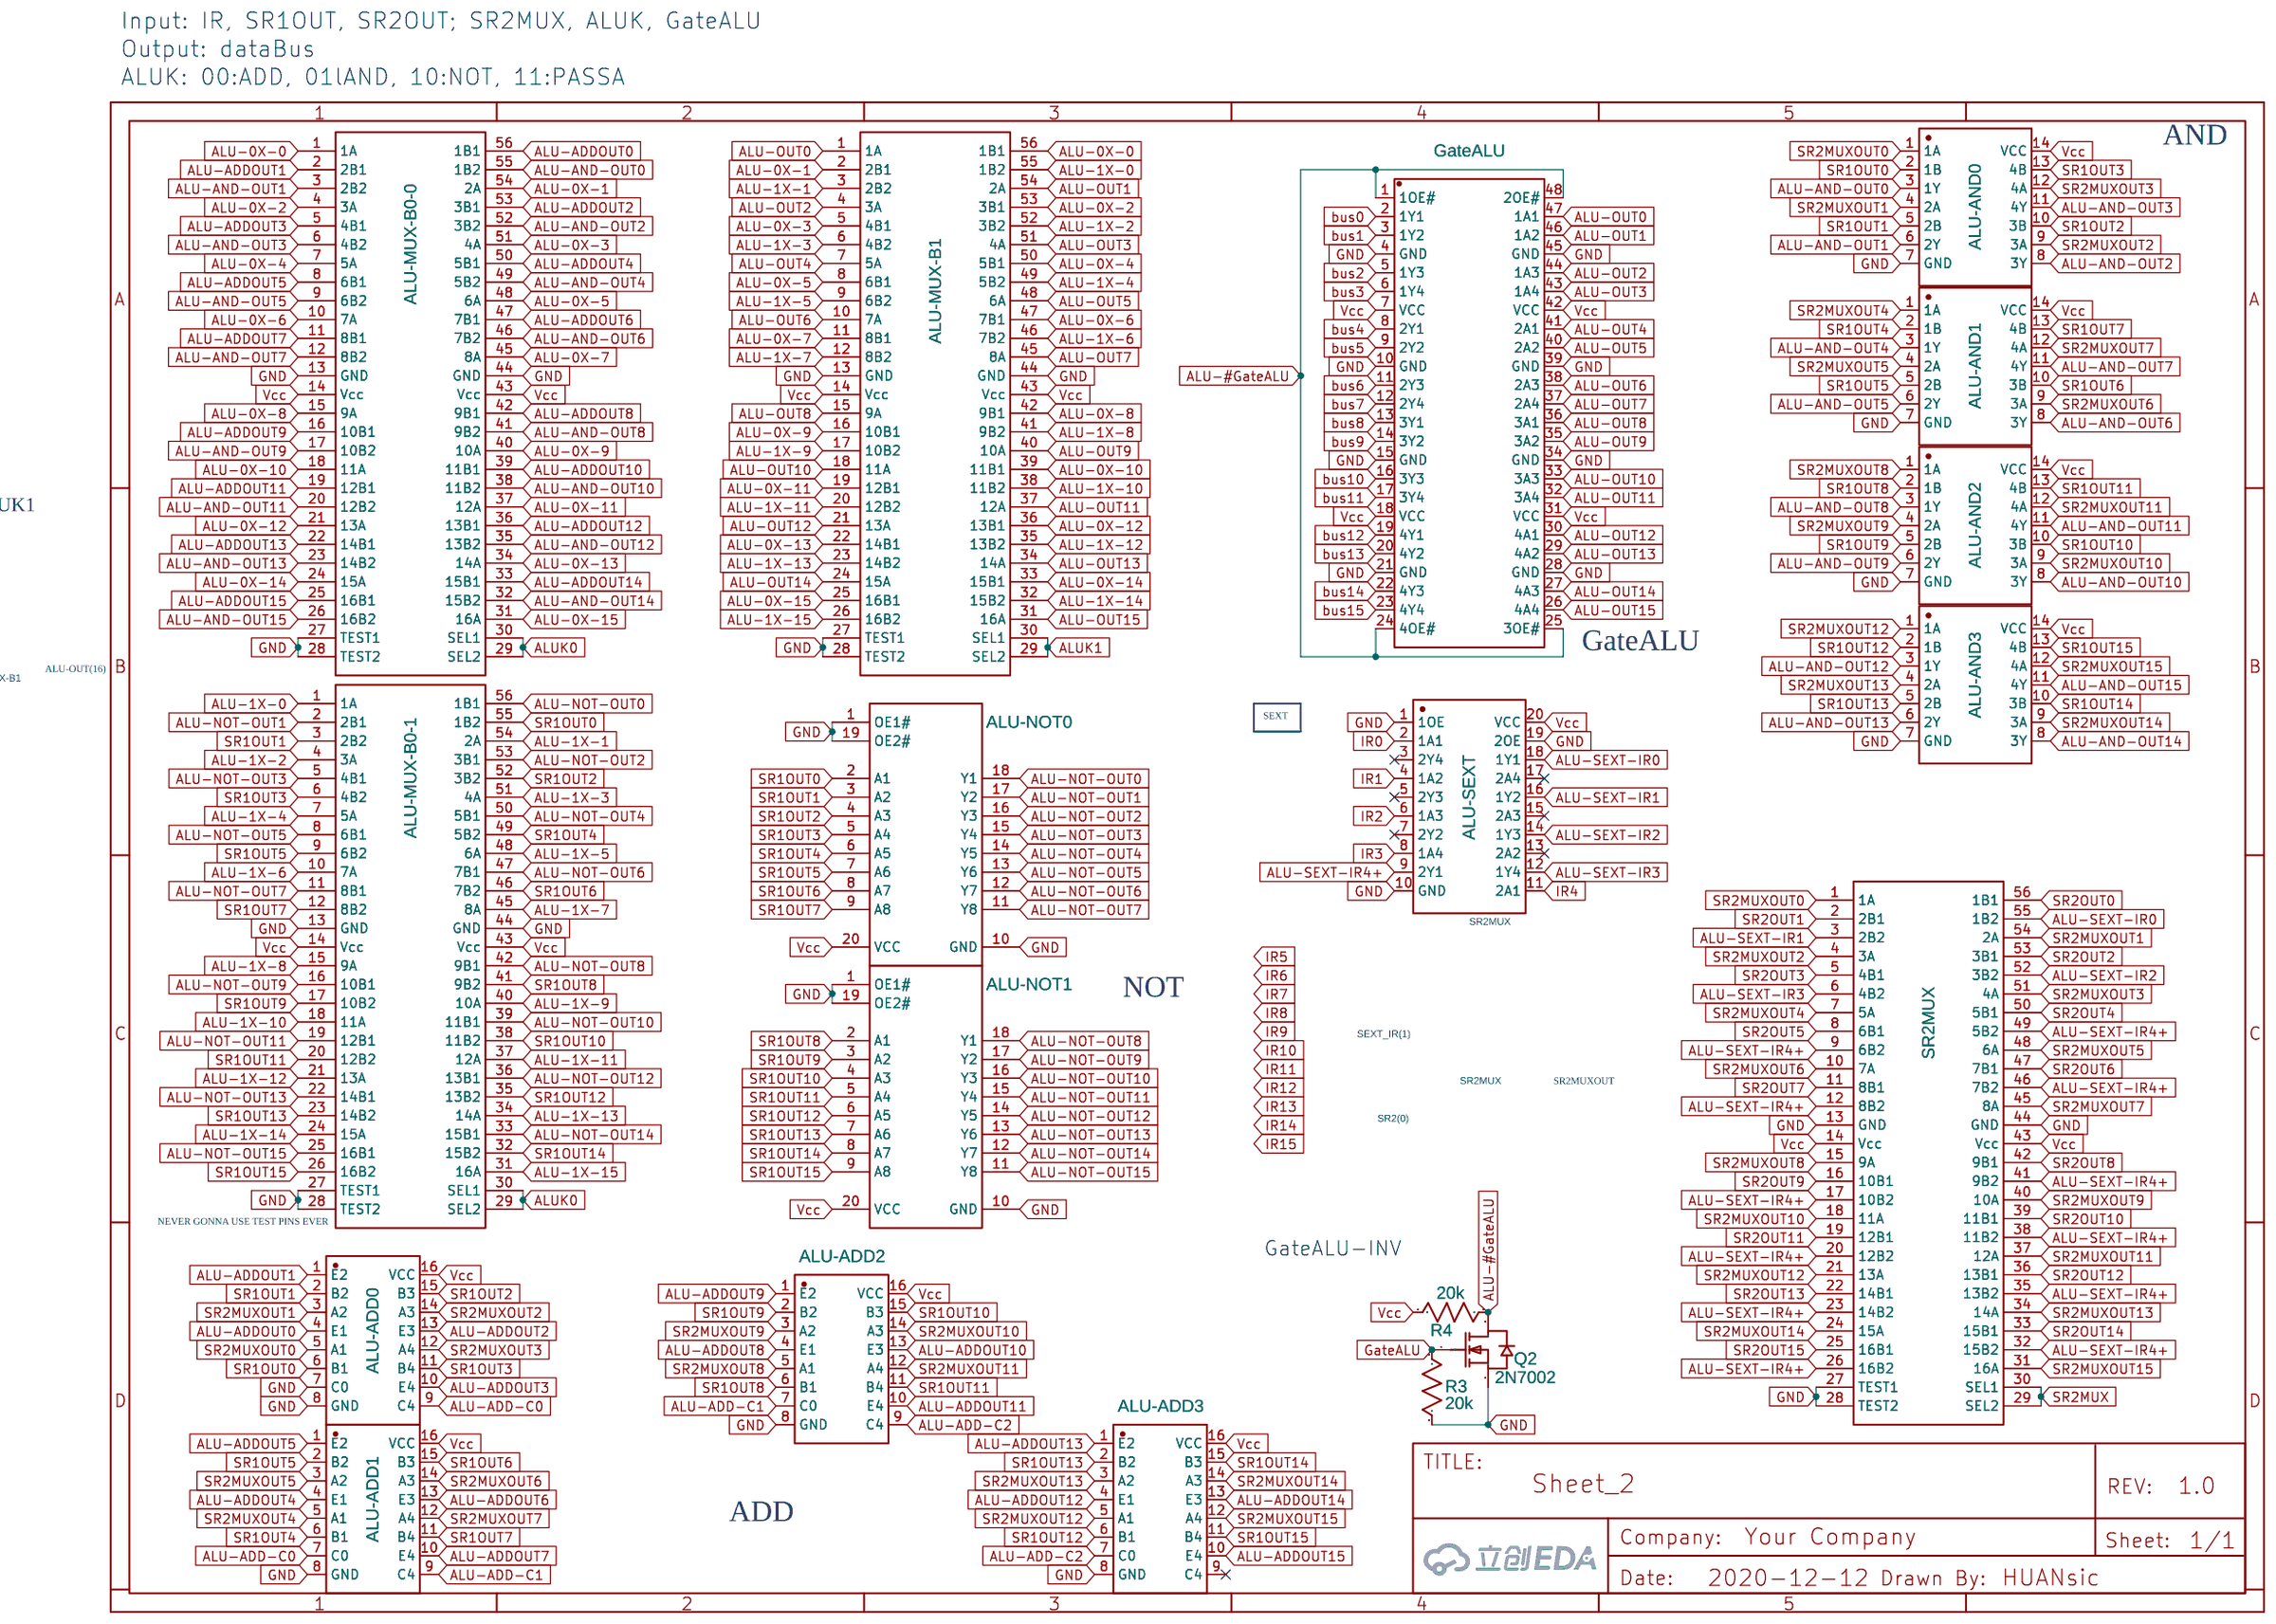
[diagram p9: ALU_]
11 MEM: TITLE: Sheet_2
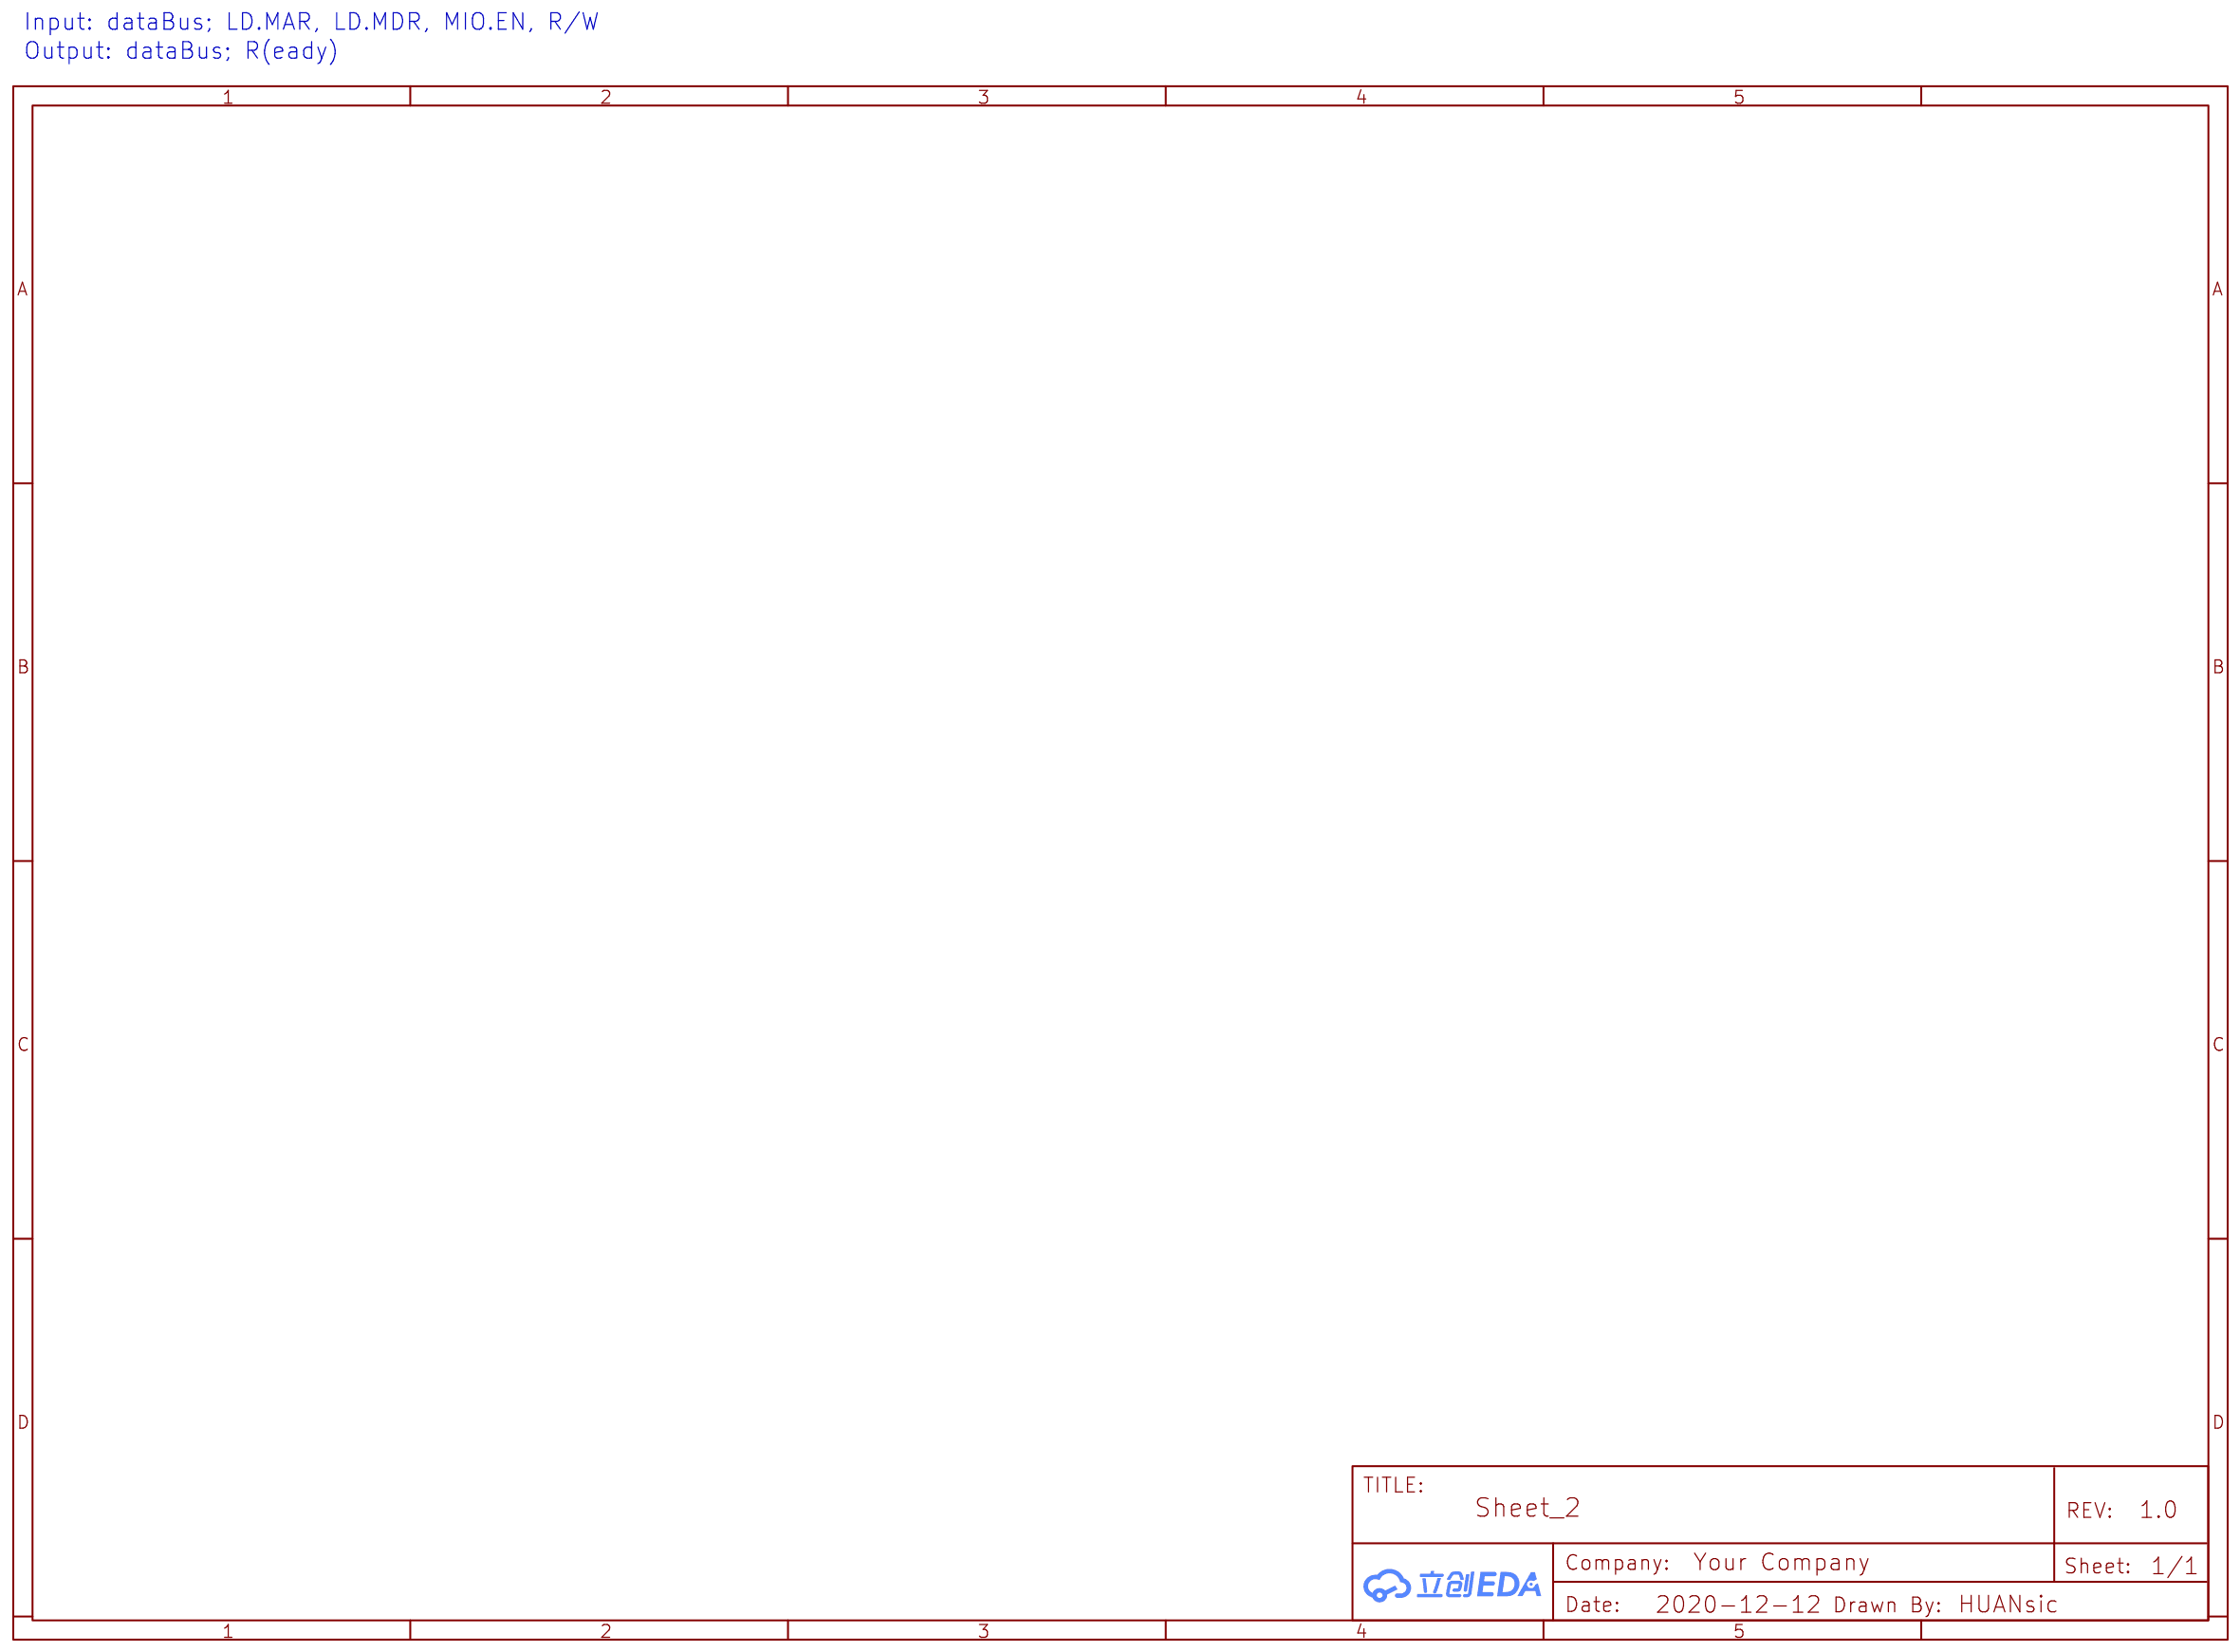
[diagram p10: MEM]
12 PWR&OTHERS: TITLE: Sheet_2; Date: 2020-12-13
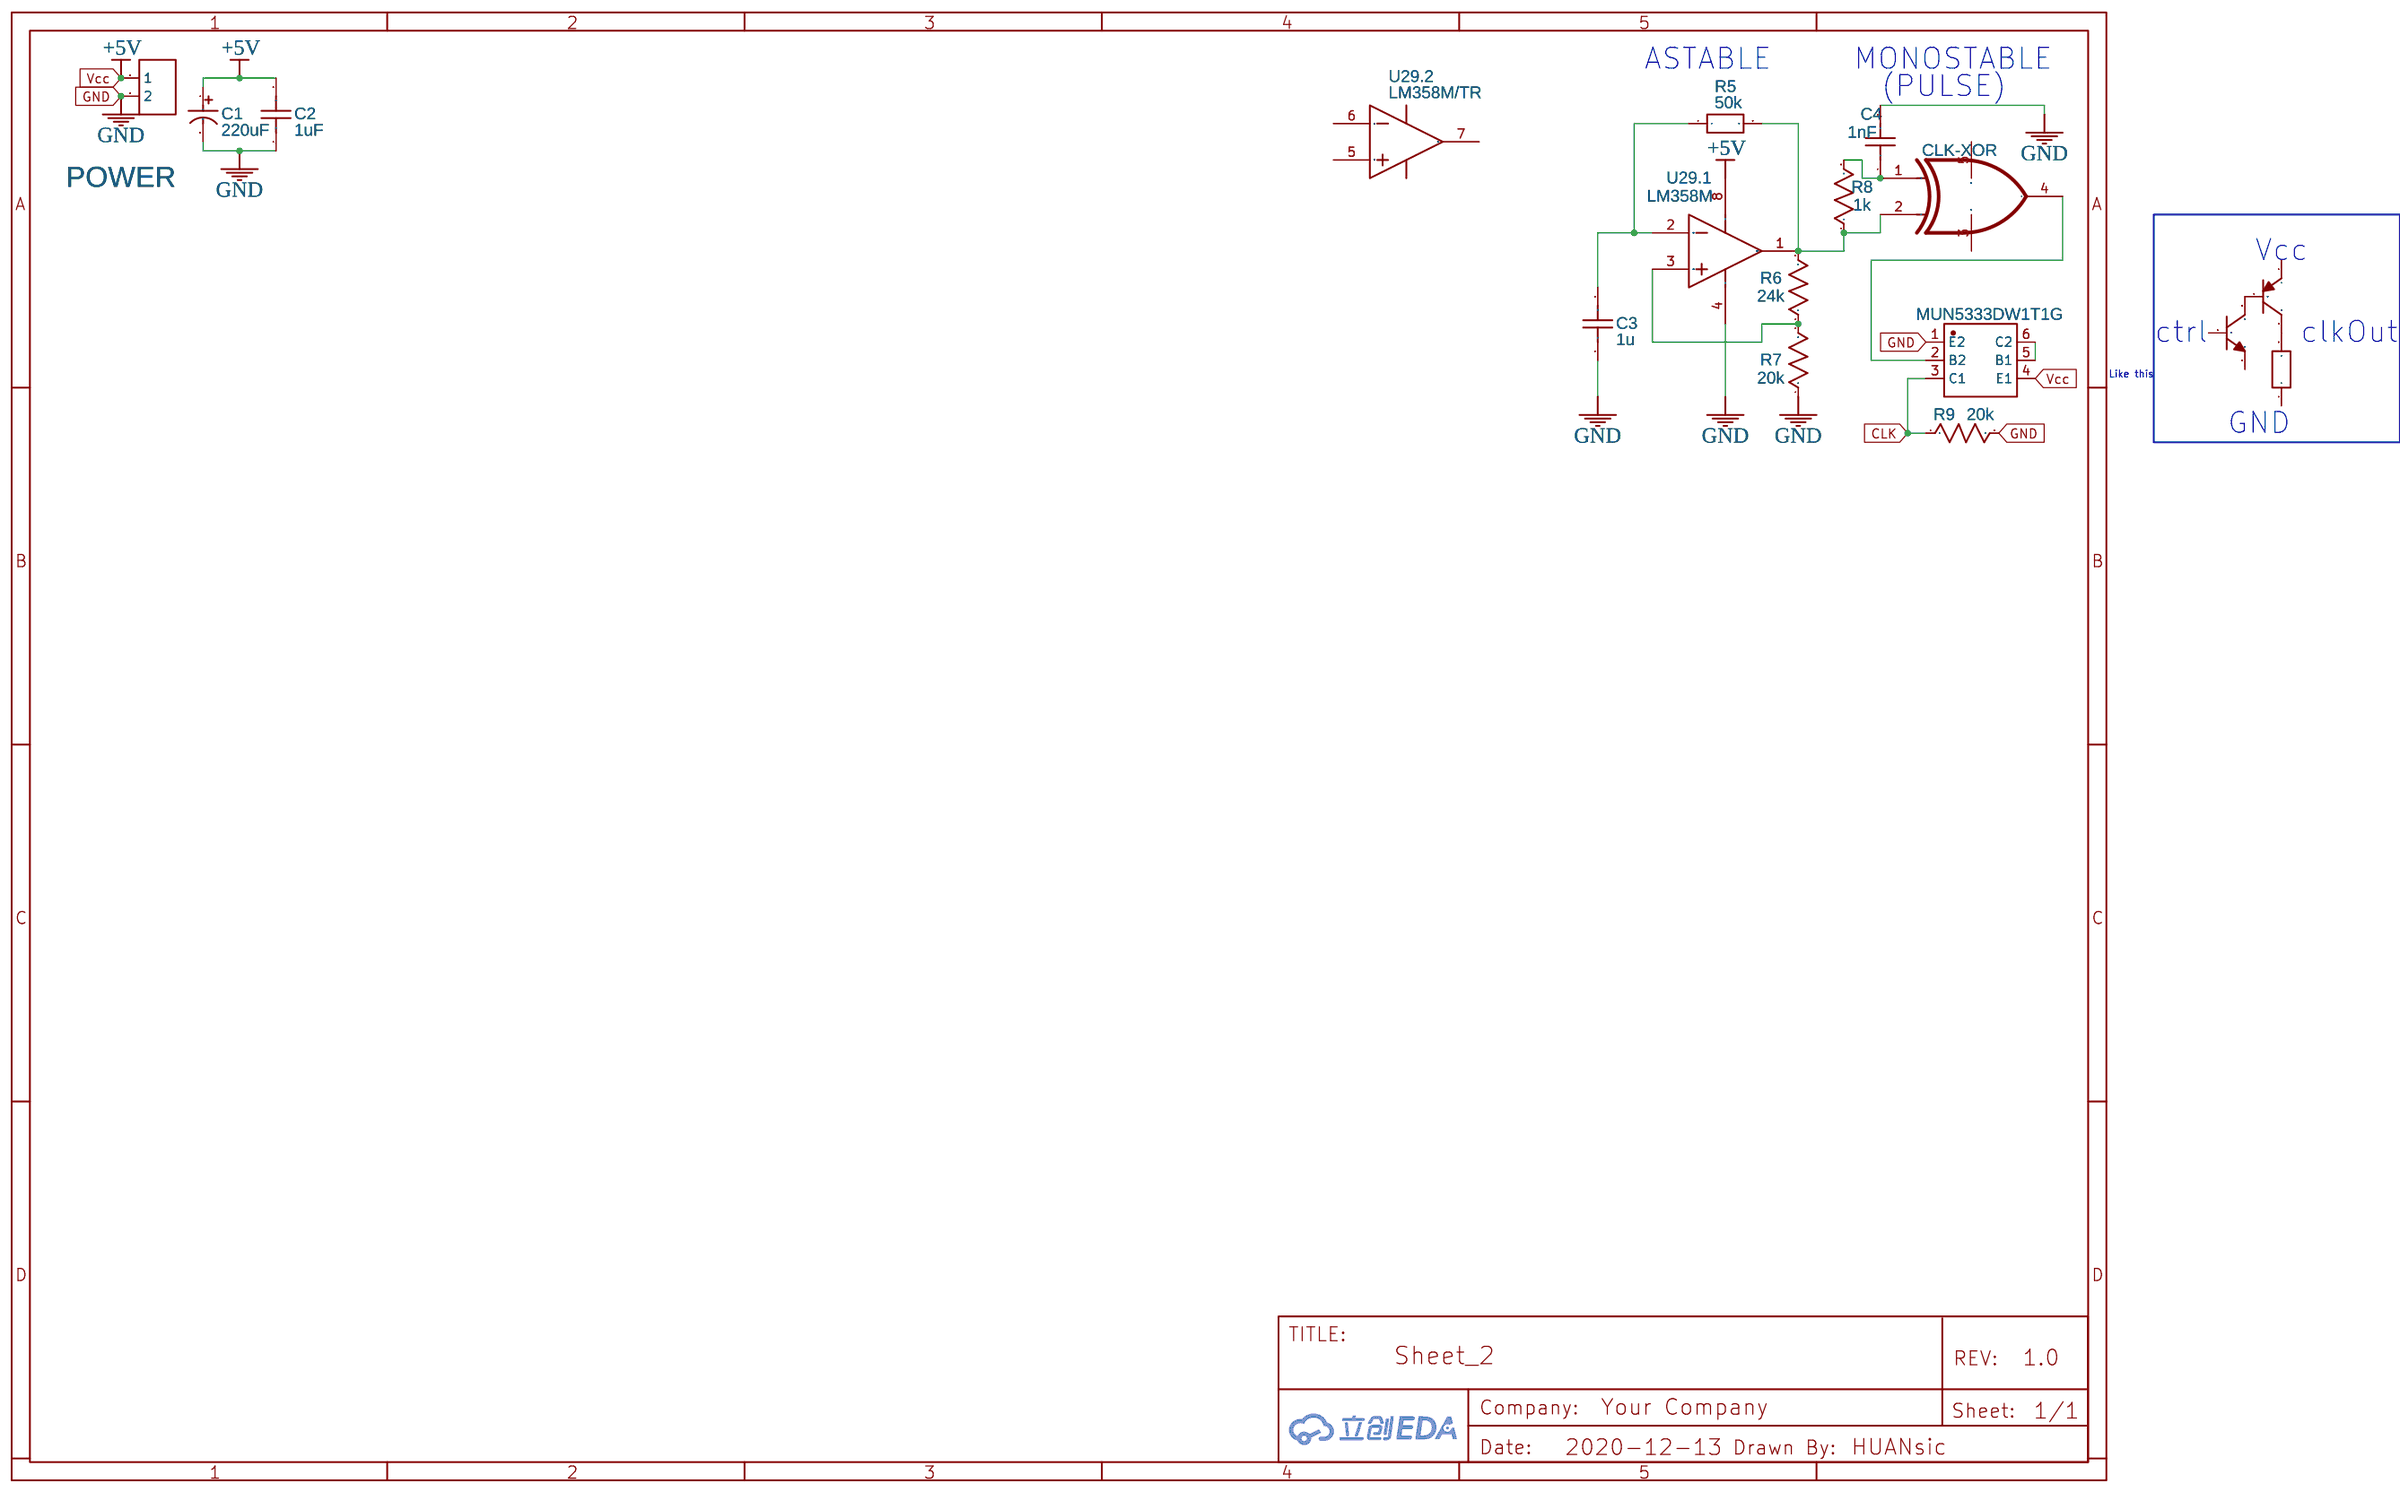
[diagram p11: PWR&OTHERS]

## Parts
sheet ALU_
Q2  2N7002  [SOT-23-3_L2.9-W1.3-P1.90-LS2.4-BR]
R3  20k  [R0805]
R4  20k  [R0805]
U4  ALU-MUX-B0-0  [16-CHANNEL MULTIPLEXER]
U5  ALU-MUX-B0-1  [16-CHANNEL MULTIPLEXER]
U6  ALU-MUX-B1  [16-CHANNEL MULTIPLEXER]
U7  GateALU  [TSSOP-48_L12.6-W6.2-P0.50-LS8.1-BL]
U8  SR2MUX  [16-CHANNEL MULTIPLEXER]
U9  ALU-SEXT  [DIP20]
U10  ALU-NOT0  [SOIC-20_L13.0-W7.6-P1.27-LS10.6-BL]
U11  ALU-NOT1  [SOIC-20_L13.0-W7.6-P1.27-LS10.6-BL]
U12  ALU-AND0  [SOIC-14_L8.7-W3.9-P1.27-LS6.0-BL]
U13  ALU-AND1  [SOIC-14_L8.7-W3.9-P1.27-LS6.0-BL]
U14  ALU-AND2  [SOIC-14_L8.7-W3.9-P1.27-LS6.0-BL]
U15  ALU-AND3  [SOIC-14_L8.7-W3.9-P1.27-LS6.0-BL]
U16  ALU-ADD0  [DIP-16_L19.8-W6.5-P2.54-LS7.6-BL]
U17  ALU-ADD1  [DIP-16_L19.8-W6.5-P2.54-LS7.6-BL]
U18  ALU-ADD2  [DIP-16_L19.8-W6.5-P2.54-LS7.6-BL]
U19  ALU-ADD3  [DIP-16_L19.8-W6.5-P2.54-LS7.6-BL]
sheet PC_
Q1  2N7002  [SOT-23-3_L2.9-W1.3-P1.90-LS2.4-BR]
R1  20k  [R0805]
R2  20k  [R0805]
U1  PC-MUX1  [16-CHANNEL MULTIPLEXER]
U2  PC-MUX0  [16-CHANNEL MULTIPLEXER]
U3  PC-INC-AND0  [SOIC-14_L8.7-W3.9-P1.27-LS6.0-BL]
U20  PC-INC-AND0  [SOIC-14_L8.7-W3.9-P1.27-LS6.0-BL]
U21  PC-INC-AND0  [SOIC-14_L8.7-W3.9-P1.27-LS6.0-BL]
U22  PC-INC-AND0  [SOIC-14_L8.7-W3.9-P1.27-LS6.0-BL]
U23  PC-INC-XOR0  [SOIC-14_L8.7-W3.9-P1.27-LS6.0-BL]
U24  PC-INC-XOR1  [SOIC-14_L8.7-W3.9-P1.27-LS6.0-BL]
U25  PC-INC-XOR3  [SOIC-14_L8.7-W3.9-P1.27-LS6.0-BL]
U26  PC-INC-XOR2  [SOIC-14_L8.7-W3.9-P1.27-LS6.0-BL]
U27  GatePC  [TSSOP-48_L12.6-W6.2-P0.50-LS8.1-BL]
U28  PC  [SSOP-48_L16.0-W7.6-P0.64-LS10.7-BL]
sheet PWR&OTHERS
C1  220uF  [CAP-TH_BD6.3-P2.50-D1.0-FD]
C2  1uF  [C0805]
C3  1u  [C0805]
C4  1nF  [C0805]
J1  POWER  [HDR-M-2.54_1X2]
Q3  MUN5333DW1T1G  [SOT-363_L2.0-W1.3-P0.65-LS2.1-BL]
Q4  2N3904(SOT-23)  [SOT-23-3_L2.9-W1.3-P1.90-LS2.4-TR]
Q5  2N3906(SOT-23)  [SOT-23-3_L2.9-W1.6-P1.90-LS2.8-TR-CW]
R5  50k  [R_AXIAL-0.4]
R6  24k  [R0805]
R7  20k  [R0805]
R8  1k  [R0805]
R9  20k  [R0805]
R10  1k  [R_AXIAL-0.4]
U29  LM358M  [SOP-8_L4.9-W3.9-P1.27-LS6.0-BL]  (sections 1,2)
U30  CLK-XOR  [SOT-23-5_L3.0-W1.7-P0.95-LS2.8-BR]

## Library data of the parts
Q1 Q2 = 2N7002: Supplier: LCSC; Manufacturer: CJ; image: //image.lceda.cn/szlcsc/C8545.jpg; Supplier Part: C8545; SMT Type: Basic; JLCPCB SMD: Yes
R1-R4 R6-R9 = R_0805_US: Contributor: LCEDA_Lib
U1 U2 U4-U6 U8 = SN74CBT16233DGGR: Contributor: lalufani; Supplier: Mouser
U7 U27 = SN74AHCT16244DGGR: Supplier: LCSC; Manufacturer: TI; image: //image.lceda.cn/szlcsc/C7482.jpg; Supplier Part: C7482; SMT Type: Extend; JLCPCB SMD: Yes
U9 = CD74FCT244E
U10 U11 = SN74HC540DWR_C133854: Supplier: LCSC; Manufacturer: TI; Manufacturer Part: SN74HC540DWR; Supplier Part: C133854; SMT Type: Extend; JLCPCB SMD: Yes
U12-U15 = SN74LS08DR: Supplier: LCSC; Manufacturer: TI; image: //image.lceda.cn/szlcsc/C6802.jpg; Supplier Part: C6802; SMT Type: Extend; JLCPCB SMD: Yes
U16-U19 = XD74LS283: Supplier: LCSC; Supplier Part: C561301; Manufacturer: XINLUDA; Contributor: LCSC
U3 U20-U22 = SN74HC08DRG4: Supplier: LCSC; Manufacturer: TI; image: //image.lceda.cn/szlcsc/C7641.jpg; Supplier Part: C7641; SMT Type: Extend; JLCPCB SMD: Yes
U23-U26 = SN74HC86DR: Supplier: LCSC; Manufacturer: TI; image: //image.lceda.cn/szlcsc/C6763.jpg; Supplier Part: C6763; SMT Type: Extend; JLCPCB SMD: Yes
U28 = SN74ACT16373DLR: Supplier: LCSC; Manufacturer: TI; image: //image.lceda.cn/szlcsc/C6927.jpg; Supplier Part: C6927
C1 = 220uF 16V Black high frequency: Supplier: LCSC; Manufacturer: ValuePro; Supplier Part: C35799
C2-C4 = C_0805_US: Contributor: LCEDA_Lib
J1 = HDR-M-2.54_1x2: Supplier Part: C124375; Supplier: LCSC; Contributor: LCEDA_Lib
Q3 = MUN5333DW1T1G: Supplier: LCSC; Supplier Part: C391239; Manufacturer: ON Semicon; Contributor: LCSC
Q4 = 2N3904(SOT-23): Supplier: LCSC; Manufacturer: KEC; Manufacturer Part: 2n3904S-RTK/PS; Supplier Part: C18536; SMT Type: SOT-23; Contributor: LCEDA_Lib
Q5 = 2N3906(SOT-23): Supplier: LCSC; Manufacturer: KEC; Manufacturer Part: 2N3906S-RTK/PS; Contributor: LCEDA_Lib; Supplier Part: C147294
R5 R10 = R_AXIAL-0.4_EU: Contributor: LCEDA_Lib
U29 = LM358M/TR: Supplier: LCSC; Supplier Part: C398078; Manufacturer: HGSEMI; subpart_no: 1
U30 = NC7S86M5X: Supplier: LCSC; Manufacturer: FAIRCHILD; image: //image.lceda.cn/szlcsc/C7418.jpg; Supplier Part: C7418; SMT Type: Extend; JLCPCB SMD: Yes

## Nets
+5V: C1.1 C2.2 J1.1 Q3.4(E1) R1.2 R4.2 U1.14(Vcc) U1.43(Vcc) U2.14(Vcc) U2.43(Vcc) U3.2(1B) U3.14(VCC) U4.14(Vcc) U4.43(Vcc) U5.14(Vcc) U5.43(Vcc) U6.14(Vcc) U6.43(Vcc) U7.7(VCC) U7.18(VCC) U7.31(VCC) U7.42(VCC) U8.14(Vcc) U8.43(Vcc) U9.20(VCC) U10.20(VCC) U11.20(VCC) U12.14(VCC) U13.14(VCC) U14.14(VCC) U15.14(VCC) U16.16(VCC) U17.16(VCC) U18.16(VCC) U19.16(VCC) U20.14(VCC) U21.14(VCC) U22.14(VCC) U23.2(1B) U23.14(VCC) U24.14(VCC) U25.14(VCC) U26.14(VCC) U27.7(VCC) U27.18(VCC) U27.31(VCC) U27.42(VCC) U28.7(VCC) U28.18(VCC) U28.31(VCC) U28.42(VCC) U29.8(VCC)
GND: C1.2 C2.1 C3.1 C4.2 J1.2 Q1.2(S) Q2.2(S) Q3.1(E2) R2.1 R3.1 R7.1 R9.2 U1.13(GND) U1.44(GND) U2.13(GND) U2.44(GND) U3.7(GND) U4.13(GND) U4.27(TEST1) U4.28(TEST2) U4.44(GND) U5.13(GND) U5.27(TEST1) U5.28(TEST2) U5.44(GND) U6.13(GND) U6.27(TEST1) U6.28(TEST2) U6.44(GND) U7.4(GND) U7.10(GND) U7.15(GND) U7.21(GND) U7.28(GND) U7.34(GND) U7.39(GND) U7.45(GND) U8.13(GND) U8.27(TEST1) U8.28(TEST2) U8.44(GND) U9.1(1OE) U9.10(GND) U9.19(2OE) U10.1(OE1#) U10.10(GND) U10.19(OE2#) U11.1(OE1#) U11.10(GND) U11.19(OE2#) U12.7(GND) U13.7(GND) U14.7(GND) U15.7(GND) U16.7(C0) U16.8(GND) U17.8(GND) U18.8(GND) U19.8(GND) U20.7(GND) U21.7(GND) U22.7(GND) U23.7(GND) U24.7(GND) U25.7(GND) U26.7(GND) U27.4(GND) U27.10(GND) U27.15(GND) U27.21(GND) U27.28(GND) U27.34(GND) U27.39(GND) U27.45(GND) U28.1(1OE#) U28.4(GND) U28.10(GND) U28.15(GND) U28.21(GND) U28.24(2OE#) U28.28(GND) U28.34(GND) U28.39(GND) U28.45(GND) U29.4(GND)
ADDROUT0: U1.55(1B2)
ADDROUT1: U1.3(2B2)
ADDROUT2: U1.52(3B2)
ADDROUT3: U1.6(4B2)
ADDROUT4: U1.49(5B2)
ADDROUT5: U1.9(6B2)
ADDROUT6: U1.46(7B2)
ADDROUT7: U1.12(8B2)
ADDROUT8: U1.41(9B2)
ADDROUT9: U1.17(10B2)
ADDROUT10: U1.38(11B2)
ADDROUT11: U1.20(12B2)
ADDROUT12: U1.35(13B2)
ADDROUT13: U1.23(14B2)
ADDROUT14: U1.32(15B2)
ADDROUT15: U1.26(16B2)
ALU-0X-0: U4.1(1A) U6.56(1B1)
ALU-0X-1: U4.54(2A) U6.2(2B1)
ALU-0X-2: U4.4(3A) U6.53(3B1)
ALU-0X-3: U4.51(4A) U6.5(4B1)
ALU-0X-4: U4.7(5A) U6.50(5B1)
ALU-0X-5: U4.48(6A) U6.8(6B1)
ALU-0X-6: U4.10(7A) U6.47(7B1)
ALU-0X-7: U4.45(8A) U6.11(8B1)
ALU-0X-8: U4.15(9A) U6.42(9B1)
ALU-0X-9: U4.40(10A) U6.16(10B1)
ALU-0X-10: U4.18(11A) U6.39(11B1)
ALU-0X-11: U4.37(12A) U6.19(12B1)
ALU-0X-12: U4.21(13A) U6.36(13B1)
ALU-0X-13: U4.34(14A) U6.22(14B1)
ALU-0X-14: U4.24(15A) U6.33(15B1)
ALU-0X-15: U4.31(16A) U6.25(16B1)
ALU-1X-0: U5.1(1A) U6.55(1B2)
ALU-1X-1: U5.54(2A) U6.3(2B2)
ALU-1X-2: U5.4(3A) U6.52(3B2)
ALU-1X-3: U5.51(4A) U6.6(4B2)
ALU-1X-4: U5.7(5A) U6.49(5B2)
ALU-1X-5: U5.48(6A) U6.9(6B2)
ALU-1X-6: U5.10(7A) U6.46(7B2)
ALU-1X-7: U5.45(8A) U6.12(8B2)
ALU-1X-8: U5.15(9A) U6.41(9B2)
ALU-1X-9: U5.40(10A) U6.17(10B2)
ALU-1X-10: U5.18(11A) U6.38(11B2)
ALU-1X-11: U5.37(12A) U6.20(12B2)
ALU-1X-12: U5.21(13A) U6.35(13B2)
ALU-1X-13: U5.34(14A) U6.23(14B2)
ALU-1X-14: U5.24(15A) U6.32(15B2)
ALU-1X-15: U5.31(16A) U6.26(16B2)
ALU-#GateALU: Q2.3(D) R4.1 U7.1(1OE#) U7.24(4OE#) U7.25(3OE#) U7.48(2OE#)
ALU-ADD-C0: U16.9(C4) U17.7(C0)
ALU-ADD-C1: U17.9(C4) U18.7(C0)
ALU-ADD-C2: U18.9(C4) U19.7(C0)
ALU-ADDOUT0: U4.56(1B1) U16.4(E1)
ALU-ADDOUT1: U4.2(2B1) U16.1(E2)
ALU-ADDOUT2: U4.53(3B1) U16.13(E3)
ALU-ADDOUT3: U4.5(4B1) U16.10(E4)
ALU-ADDOUT4: U4.50(5B1) U17.4(E1)
ALU-ADDOUT5: U4.8(6B1) U17.1(E2)
ALU-ADDOUT6: U4.47(7B1) U17.13(E3)
ALU-ADDOUT7: U4.11(8B1) U17.10(E4)
ALU-ADDOUT8: U4.42(9B1) U18.4(E1)
ALU-ADDOUT9: U4.16(10B1) U18.1(E2)
ALU-ADDOUT10: U4.39(11B1) U18.13(E3)
ALU-ADDOUT11: U4.19(12B1) U18.10(E4)
ALU-ADDOUT12: U4.36(13B1) U19.4(E1)
ALU-ADDOUT13: U4.22(14B1) U19.1(E2)
ALU-ADDOUT14: U4.33(15B1) U19.13(E3)
ALU-ADDOUT15: U4.25(16B1) U19.10(E4)
ALU-AND-OUT0: U4.55(1B2) U12.3(1Y)
ALU-AND-OUT1: U4.3(2B2) U12.6(2Y)
ALU-AND-OUT2: U4.52(3B2) U12.8(3Y)
ALU-AND-OUT3: U4.6(4B2) U12.11(4Y)
ALU-AND-OUT4: U4.49(5B2) U13.3(1Y)
ALU-AND-OUT5: U4.9(6B2) U13.6(2Y)
ALU-AND-OUT6: U4.46(7B2) U13.8(3Y)
ALU-AND-OUT7: U4.12(8B2) U13.11(4Y)
ALU-AND-OUT8: U4.41(9B2) U14.3(1Y)
ALU-AND-OUT9: U4.17(10B2) U14.6(2Y)
ALU-AND-OUT10: U4.38(11B2) U14.8(3Y)
ALU-AND-OUT11: U4.20(12B2) U14.11(4Y)
ALU-AND-OUT12: U4.35(13B2) U15.3(1Y)
ALU-AND-OUT13: U4.23(14B2) U15.6(2Y)
ALU-AND-OUT14: U4.32(15B2) U15.8(3Y)
ALU-AND-OUT15: U4.26(16B2) U15.11(4Y)
ALU-NOT-OUT0: U5.56(1B1) U10.18(Y1)
ALU-NOT-OUT1: U5.2(2B1) U10.17(Y2)
ALU-NOT-OUT2: U5.53(3B1) U10.16(Y3)
ALU-NOT-OUT3: U5.5(4B1) U10.15(Y4)
ALU-NOT-OUT4: U5.50(5B1) U10.14(Y5)
ALU-NOT-OUT5: U5.8(6B1) U10.13(Y6)
ALU-NOT-OUT6: U5.47(7B1) U10.12(Y7)
ALU-NOT-OUT7: U5.11(8B1) U10.11(Y8)
ALU-NOT-OUT8: U5.42(9B1) U11.18(Y1)
ALU-NOT-OUT9: U5.16(10B1) U11.17(Y2)
ALU-NOT-OUT10: U5.39(11B1) U11.16(Y3)
ALU-NOT-OUT11: U5.19(12B1) U11.15(Y4)
ALU-NOT-OUT12: U5.36(13B1) U11.14(Y5)
ALU-NOT-OUT13: U5.22(14B1) U11.13(Y6)
ALU-NOT-OUT14: U5.33(15B1) U11.12(Y7)
ALU-NOT-OUT15: U5.25(16B1) U11.11(Y8)
ALU-OUT0: U6.1(1A) U7.47(1A1)
ALU-OUT1: U6.54(2A) U7.46(1A2)
ALU-OUT2: U6.4(3A) U7.44(1A3)
ALU-OUT3: U6.51(4A) U7.43(1A4)
ALU-OUT4: U6.7(5A) U7.41(2A1)
ALU-OUT5: U6.48(6A) U7.40(2A2)
ALU-OUT6: U6.10(7A) U7.38(2A3)
ALU-OUT7: U6.45(8A) U7.37(2A4)
ALU-OUT8: U6.15(9A) U7.36(3A1)
ALU-OUT9: U6.40(10A) U7.35(3A2)
ALU-OUT10: U6.18(11A) U7.33(3A3)
ALU-OUT11: U6.37(12A) U7.32(3A4)
ALU-OUT12: U6.21(13A) U7.30(4A1)
ALU-OUT13: U6.34(14A) U7.29(4A2)
ALU-OUT14: U6.24(15A) U7.27(4A3)
ALU-OUT15: U6.31(16A) U7.26(4A4)
ALU-SEXT-IR0: U8.55(1B2) U9.18(1Y1)
ALU-SEXT-IR1: U8.3(2B2) U9.16(1Y2)
ALU-SEXT-IR2: U8.52(3B2) U9.14(1Y3)
ALU-SEXT-IR3: U8.6(4B2) U9.12(1Y4)
ALU-SEXT-IR4+: U8.9(6B2) U8.12(8B2) U8.17(10B2) U8.20(12B2) U8.23(14B2) U8.26(16B2) U8.32(15B2) U8.35(13B2) U8.38(11B2) U8.41(9B2) U8.46(7B2) U8.49(5B2) U9.9(2Y1)
ALUK0: U4.29(SEL2) U4.30(SEL1) U5.29(SEL2) U5.30(SEL1)
ALUK1: U6.29(SEL2) U6.30(SEL1)
bus0: U2.55(1B2) U7.2(1Y1) U27.2(1Y1)
bus1: U2.3(2B2) U7.3(1Y2) U27.3(1Y2)
bus2: U2.52(3B2) U7.5(1Y3) U27.5(1Y3)
bus3: U2.6(4B2) U7.6(1Y4) U27.6(1Y4)
bus4: U2.49(5B2) U7.8(2Y1) U27.8(2Y1)
bus5: U2.9(6B2) U7.9(2Y2) U27.9(2Y2)
bus6: U2.46(7B2) U7.11(2Y3) U27.11(2Y3)
bus7: U2.12(8B2) U7.12(2Y4) U27.12(2Y4)
bus8: U2.41(9B2) U7.13(3Y1) U27.13(3Y1)
bus9: U2.17(10B2) U7.14(3Y2) U27.14(3Y2)
bus10: U2.38(11B2) U7.16(3Y3) U27.16(3Y3)
bus11: U2.20(12B2) U7.17(3Y4) U27.17(3Y4)
bus12: U2.35(13B2) U7.19(4Y1) U27.19(4Y1)
bus13: U2.23(14B2) U7.20(4Y2) U27.20(4Y2)
bus14: U2.32(15B2) U7.22(4Y3) U27.22(4Y3)
bus15: U2.26(16B2) U7.23(4Y4) U27.23(4Y4)
CLK: Q3.3(C1) R9.1
GateALU: Q2.1(G) R3.2
GatePC: Q1.1(G) R2.2
IR0: U9.2(1A1)
IR1: U9.4(1A2)
IR2: U9.6(1A3)
IR3: U9.8(1A4)
IR4: U9.11(2A1)
LD.PC: U28.25(2C) U28.48(1C)
PC0: U3.1(1A) U23.1(1A) U27.47(1A1) U28.2(1Q1)
PC1: U3.4(2A) U23.4(2A) U27.46(1A2) U28.3(1Q2)
PC2: U3.9(3A) U23.9(3A) U27.44(1A3) U28.5(1Q3)
PC3: U3.12(4A) U23.12(4A) U27.43(1A4) U28.6(1Q4)
PC4: U20.1(1A) U24.1(1A) U27.41(2A1) U28.8(1Q5)
PC5: U20.4(2A) U24.4(2A) U27.40(2A2) U28.9(1Q6)
PC6: U20.9(3A) U24.9(3A) U27.38(2A3) U28.11(1Q7)
PC7: U20.12(4A) U24.12(4A) U27.37(2A4) U28.12(1Q8)
PC8: U22.1(1A) U26.1(1A) U27.36(3A1) U28.13(2Q1)
PC9: U22.4(2A) U26.4(2A) U27.35(3A2) U28.14(2Q2)
PC10: U22.9(3A) U26.9(3A) U27.33(3A3) U28.16(2Q3)
PC11: U22.12(4A) U26.12(4A) U27.32(3A4) U28.17(2Q4)
PC12: U21.1(1A) U25.1(1A) U27.30(4A1) U28.19(2Q5)
PC13: U21.4(2A) U25.4(2A) U27.29(4A2) U28.20(2Q6)
PC14: U21.9(3A) U25.9(3A) U27.27(4A3) U28.22(2Q7)
PC15: U21.12(4A) U25.12(4A) U27.26(4A4) U28.23(2Q8)
PC-#GatePC: Q1.3(D) R1.1 U27.1(1OE#) U27.24(4OE#) U27.25(3OE#) U27.48(2OE#)
PC-INC-C0: U3.3(1Y) U3.5(2B) U23.5(2B)
PC-INC-C1: U3.6(2Y) U3.10(3B) U23.10(3B)
PC-INC-C2: U3.8(3Y) U3.13(4B) U23.13(4B)
PC-INC-C3: U3.11(4Y) U20.2(1B) U24.2(1B)
PC-INC-C4: U20.3(1Y) U20.5(2B) U24.5(2B)
PC-INC-C5: U20.6(2Y) U20.10(3B) U24.10(3B)
PC-INC-C6: U20.8(3Y) U20.13(4B) U24.13(4B)
PC-INC-C7: U20.11(4Y) U22.2(1B) U26.2(1B)
PC-INC-C8: U22.3(1Y) U22.5(2B) U26.5(2B)
PC-INC-C9: U22.6(2Y) U22.10(3B) U26.10(3B)
PC-INC-C10: U22.8(3Y) U22.13(4B) U26.13(4B)
PC-INC-C11: U21.2(1B) U22.11(4Y) U25.2(1B)
PC-INC-C12: U21.3(1Y) U21.5(2B) U25.5(2B)
PC-INC-C13: U21.6(2Y) U21.10(3B) U25.10(3B)
PC-INC-C14: U21.8(3Y) U21.13(4B) U25.13(4B)
PC-INCPC0: U1.56(1B1) U23.3(1Y)
PC-INCPC1: U1.2(2B1) U23.6(2Y)
PC-INCPC2: U1.53(3B1) U23.8(3Y)
PC-INCPC3: U1.5(4B1) U23.11(4Y)
PC-INCPC4: U1.50(5B1) U24.3(1Y)
PC-INCPC5: U1.8(6B1) U24.6(2Y)
PC-INCPC6: U1.47(7B1) U24.8(3Y)
PC-INCPC7: U1.11(8B1) U24.11(4Y)
PC-INCPC8: U1.42(9B1) U26.3(1Y)
PC-INCPC9: U1.16(10B1) U26.6(2Y)
PC-INCPC10: U1.39(11B1) U26.8(3Y)
PC-INCPC11: U1.19(12B1) U26.11(4Y)
PC-INCPC12: U1.36(13B1) U25.3(1Y)
PC-INCPC13: U1.22(14B1) U25.6(2Y)
PC-INCPC14: U1.33(15B1) U25.8(3Y)
PC-INCPC15: U1.25(16B1) U25.11(4Y)
PC-MUX1OUT-0: U1.1(1A) U2.56(1B1)
PC-MUX1OUT-1: U1.54(2A) U2.2(2B1)
PC-MUX1OUT-2: U1.4(3A) U2.53(3B1)
PC-MUX1OUT-3: U1.51(4A) U2.5(4B1)
PC-MUX1OUT-4: U1.7(5A) U2.50(5B1)
PC-MUX1OUT-5: U1.48(6A) U2.8(6B1)
PC-MUX1OUT-6: U1.10(7A) U2.47(7B1)
PC-MUX1OUT-7: U1.45(8A) U2.11(8B1)
PC-MUX1OUT-8: U1.15(9A) U2.42(9B1)
PC-MUX1OUT-9: U1.40(10A) U2.16(10B1)
PC-MUX1OUT-10: U1.18(11A) U2.39(11B1)
PC-MUX1OUT-11: U1.37(12A) U2.19(12B1)
PC-MUX1OUT-12: U1.21(13A) U2.36(13B1)
PC-MUX1OUT-13: U1.34(14A) U2.22(14B1)
PC-MUX1OUT-14: U1.24(15A) U2.33(15B1)
PC-MUX1OUT-15: U1.31(16A) U2.25(16B1)
PC-MUXOUT0: U2.1(1A) U28.47(1D1)
PC-MUXOUT1: U2.54(2A) U28.46(1D2)
PC-MUXOUT2: U2.4(3A) U28.44(1D3)
PC-MUXOUT3: U2.51(4A) U28.43(1D4)
PC-MUXOUT4: U2.7(5A) U28.41(1D5)
PC-MUXOUT5: U2.48(6A) U28.40(1D6)
PC-MUXOUT6: U2.10(7A) U28.38(1D7)
PC-MUXOUT7: U2.45(8A) U28.37(1D8)
PC-MUXOUT8: U2.15(9A) U28.36(2D1)
PC-MUXOUT9: U2.40(10A) U28.35(2D2)
PC-MUXOUT10: U2.18(11A) U28.33(2D3)
PC-MUXOUT11: U2.37(12A) U28.32(2D4)
PC-MUXOUT12: U2.21(13A) U28.30(2D5)
PC-MUXOUT13: U2.34(14A) U28.29(2D6)
PC-MUXOUT14: U2.24(15A) U28.27(2D7)
PC-MUXOUT15: U2.31(16A) U28.26(2D8)
PCMUX0: U2.29(SEL2) U2.30(SEL1)
PCMUX1: U1.29(SEL2) U1.30(SEL1)
SR1OUT0: U5.55(1B2) U10.2(A1) U12.2(1B) U16.6(B1)
SR1OUT1: U5.3(2B2) U10.3(A2) U12.5(2B) U16.2(B2)
SR1OUT2: U5.52(3B2) U10.4(A3) U12.10(3B) U16.15(B3)
SR1OUT3: U5.6(4B2) U10.5(A4) U12.13(4B) U16.11(B4)
SR1OUT4: U5.49(5B2) U10.6(A5) U13.2(1B) U17.6(B1)
SR1OUT5: U5.9(6B2) U10.7(A6) U13.5(2B) U17.2(B2)
SR1OUT6: U5.46(7B2) U10.8(A7) U13.10(3B) U17.15(B3)
SR1OUT7: U5.12(8B2) U10.9(A8) U13.13(4B) U17.11(B4)
SR1OUT8: U5.41(9B2) U11.2(A1) U14.2(1B) U18.6(B1)
SR1OUT9: U5.17(10B2) U11.3(A2) U14.5(2B) U18.2(B2)
SR1OUT10: U5.38(11B2) U11.4(A3) U14.10(3B) U18.15(B3)
SR1OUT11: U5.20(12B2) U11.5(A4) U14.13(4B) U18.11(B4)
SR1OUT12: U5.35(13B2) U11.6(A5) U15.2(1B) U19.6(B1)
SR1OUT13: U5.23(14B2) U11.7(A6) U15.5(2B) U19.2(B2)
SR1OUT14: U5.32(15B2) U11.8(A7) U15.10(3B) U19.15(B3)
SR1OUT15: U5.26(16B2) U11.9(A8) U15.13(4B) U19.11(B4)
SR2MUX: U8.29(SEL2) U8.30(SEL1)
SR2MUXOUT0: U8.1(1A) U12.1(1A) U16.5(A1)
SR2MUXOUT1: U8.54(2A) U12.4(2A) U16.3(A2)
SR2MUXOUT2: U8.4(3A) U12.9(3A) U16.14(A3)
SR2MUXOUT3: U8.51(4A) U12.12(4A) U16.12(A4)
SR2MUXOUT4: U8.7(5A) U13.1(1A) U17.5(A1)
SR2MUXOUT5: U8.48(6A) U13.4(2A) U17.3(A2)
SR2MUXOUT6: U8.10(7A) U13.9(3A) U17.14(A3)
SR2MUXOUT7: U8.45(8A) U13.12(4A) U17.12(A4)
SR2MUXOUT8: U8.15(9A) U14.1(1A) U18.5(A1)
SR2MUXOUT9: U8.40(10A) U14.4(2A) U18.3(A2)
SR2MUXOUT10: U8.18(11A) U14.9(3A) U18.14(A3)
SR2MUXOUT11: U8.37(12A) U14.12(4A) U18.12(A4)
SR2MUXOUT12: U8.21(13A) U15.1(1A) U19.5(A1)
SR2MUXOUT13: U8.34(14A) U15.4(2A) U19.3(A2)
SR2MUXOUT14: U8.24(15A) U15.9(3A) U19.14(A3)
SR2MUXOUT15: U8.31(16A) U15.12(4A) U19.12(A4)
SR2OUT0: U8.56(1B1)
SR2OUT1: U8.2(2B1)
SR2OUT2: U8.53(3B1)
SR2OUT3: U8.5(4B1)
SR2OUT4: U8.50(5B1)
SR2OUT5: U8.8(6B1)
SR2OUT6: U8.47(7B1)
SR2OUT7: U8.11(8B1)
SR2OUT8: U8.42(9B1)
SR2OUT9: U8.16(10B1)
SR2OUT10: U8.39(11B1)
SR2OUT11: U8.19(12B1)
SR2OUT12: U8.36(13B1)
SR2OUT13: U8.22(14B1)
SR2OUT14: U8.33(15B1)
SR2OUT15: U8.25(16B1)
Net-(C3-2): C3.2 R5.1 U29.2(1IN-)
Net-(C4-1): C4.1 R8.2 U30.1(A)
Net-(Q3-2): Q3.2(B2) U30.4(Y)
Net-(Q3-5): Q3.5(B1) Q3.6(C2)
Net-(Q4-3): Q4.3(C) Q5.2(B)
Net-(Q5-3): Q5.3(C) R10.2
Net-(R5-2): R5.2 R6.2 R8.1 U29.1(1OUT) U30.2(B)
Net-(R6-1): R6.1 R7.2 U29.3(1IN+)

Not connected (* = marked no-connect by the designer): Q4 1(E) 2(B); Q5 1(E); R10 1; U1 27(TEST1)* 28(TEST2)*; U2 27(TEST1)* 28(TEST2)*; U9 3(2Y4)* 5(2Y3)* 7(2Y2)* 13(2A2)* 15(2A3)* 17(2A4)*; U19 9(C4)*; U21 11(4Y)*; U29 5(2IN+) 6(2IN-) 7(2OUT); U30 3(GND) 5(VCC)

## Notes on the sheets
sheet 1
- 额这个东西呢只是用来看的
- 大家选择了自己的那部分之后自己开一个工程然后自己肝自己的部分
- 最后传给我我放到一起
- （这里缺少一个GitHub的链接）
- 文件可以传到GitHub上   ^链接^
sheet 2
- Input: dataBus; DR(3), SR1(3), SR2(3), LD.REG
- output: SR1OUT(16), SR2OUT(16)
sheet 3
- Input: ADDROUT, dataBus; LD.PC, LDMUX(2), GatePC
- Output: PC, dataBus
- PCMUX: 00:PC+1, 01:BUS, 10:ADDER
- INC
- GatePC-INV
sheet 5
- Input: dataPath, LD.IR
- Output: IR
sheet 7
- Input: dataPath; LD.CC
- Output: N, Z, P
sheet 8
- Input: PC, SR1OUT; ADDR1MUX
- Output: ADDR1
sheet 9
- Input: IR, 0; ADDR2MUX
- Output: ADDR2
sheet 10
- Input: IR, SR1OUT, SR2OUT; SR2MUX, ALUK, GateALU
- Output: dataBus
- ALUK: 00:ADD, 01lAND, 10:NOT, 11:PASSA
- AND
- ALUK0
- ALU-00(16)
- ALUK1
- ALU-MUX-B0-0
- ALU-0X(16)
- ALU-01(16)
- GateALU
- ALU-MUX-B1
- ALU-OUT(16)
- SEXT
- ALU-10(16)
- ALU-1X(16)
- ALU-MUX-B0-1
- ALU-11(16)
- SR2MUX
- NOT
- SEXT_IR(1)
- SR2MUX
- SR2MUXOUT
- SR2(0)
- NEVER GONNA USE TEST PINS EVER
- GateALU-INV
- ADD
sheet 11
- Input: dataBus; LD.MAR, LD.MDR, MIO.EN, R/W
- Output: dataBus; R(eady)
sheet 12
- ASTABLE
- MONOSTABLE
- (PULSE)
- Vcc
- ctrl
- clkOut
- Like this
- GND
